# EAGLE design sonar_preprocessor (EAGLE 9.2.2)

## Sheet 1 of 7: Amplifier
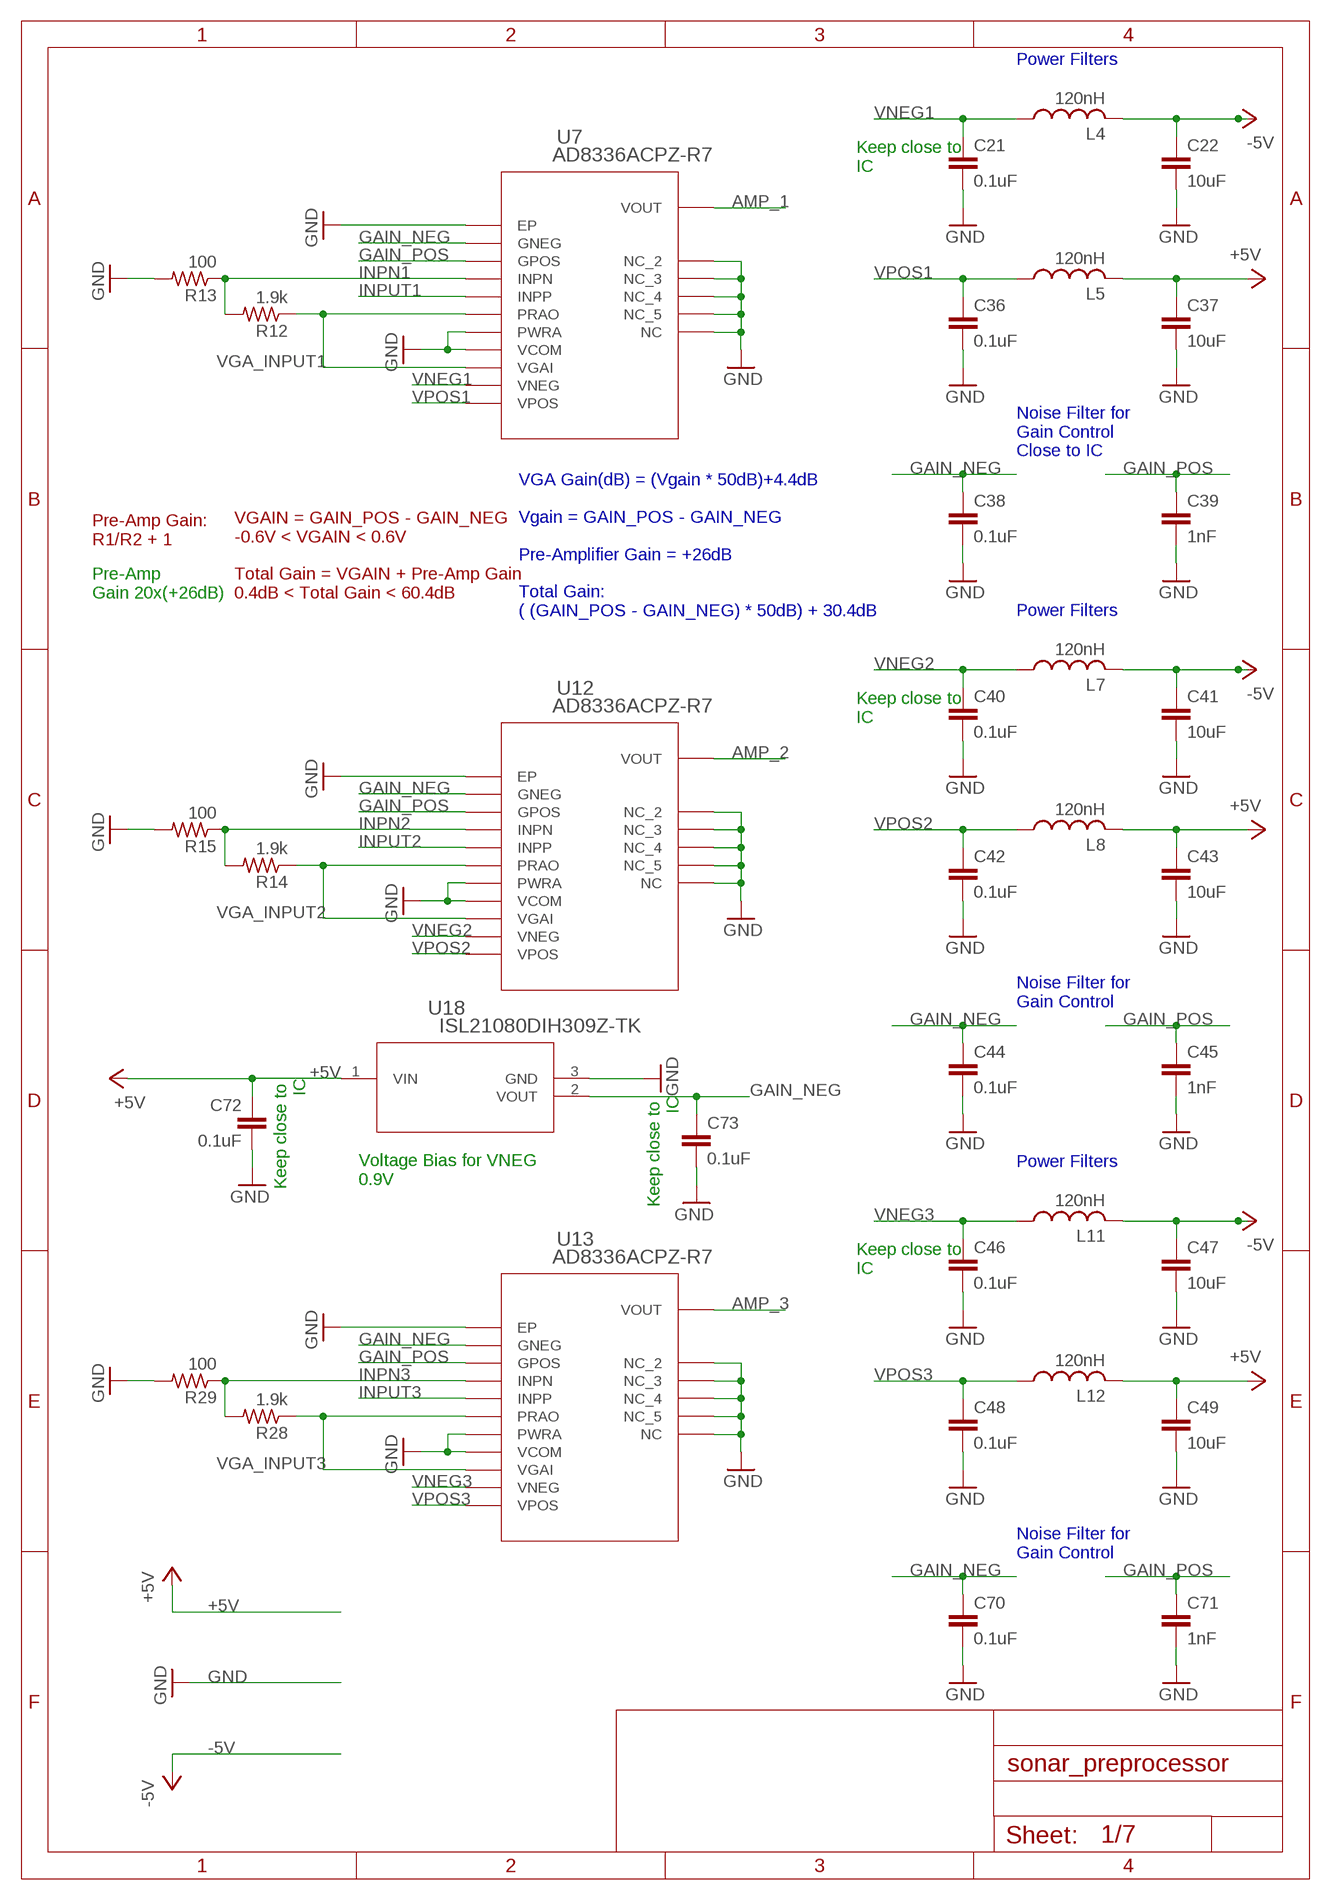
[diagram p0: schematic, sheet 1]

### Parts
C21  0.1uF  C-EUC0603  [C0603]
C22  10uF  C-EUC1206  [C1206]
C36  0.1uF  C-EUC0603  [C0603]
C37  10uF  C-EUC1206  [C1206]
C38  0.1uF  C-EUC0603  [C0603]
C39  1nF  C-EUC0603  [C0603]
C40  0.1uF  C-EUC0603  [C0603]
C41  10uF  C-EUC1206  [C1206]
C42  0.1uF  C-EUC0603  [C0603]
C43  10uF  C-EUC1206  [C1206]
C44  0.1uF  C-EUC0603  [C0603]
C45  1nF  C-EUC0603  [C0603]
C46  0.1uF  C-EUC0603  [C0603]
C47  10uF  C-EUC1206  [C1206]
C48  0.1uF  C-EUC0603  [C0603]
C49  10uF  C-EUC1206  [C1206]
C70  0.1uF  C-EUC0603  [C0603]
C71  1nF  C-EUC0603  [C0603]
C72  0.1uF  C-EUC0603  [C0603]
C73  0.1uF  C-EUC0603  [C0603]
L4  120nH  L-USL3225P  [L3225P]
L5  120nH  L-USL3225P  [L3225P]
L7  120nH  L-USL3225P  [L3225P]
L8  120nH  L-USL3225P  [L3225P]
L11  120nH  L-USL3225P  [L3225P]
L12  120nH  L-USL3225P  [L3225P]
R12  1.9k  R-US_R0603  [R0603]
R13  100  R-US_R0603  [R0603]
R14  1.9k  R-US_R0603  [R0603]
R15  100  R-US_R0603  [R0603]
R28  1.9k  R-US_R0603  [R0603]
R29  100  R-US_R0603  [R0603]
U7  AD8336ACPZ-R7  [CP_16_4]
U12  AD8336ACPZ-R7  [CP_16_4]
U13  AD8336ACPZ-R7  [CP_16_4]
U18  ISL21080DIH309Z-TK  [P3_064]

### Nets
+5V: C37.1 C43.1 C49.1 C72.1 L5.2 L8.2 L12.2 U18.1(VIN) ; also sheet 2,3,4,5,6,7
-5V: C22.1 C41.1 C47.1 L4.2 L7.2 L11.2 ; also sheet 2,5,6,7
AMP_1: U7.VOUT ; also sheet 2,6
AMP_2: U12.VOUT ; also sheet 2,6
AMP_3: U13.VOUT ; also sheet 2,6
GAIN_NEG: C38.1 C44.1 C70.1 C73.1 U7.GNEG U12.GNEG U13.GNEG U18.2(VOUT)
GAIN_POS: C39.1 C45.1 C71.1 U7.GPOS U12.GPOS U13.GPOS ; also sheet 6
GND: C21.2 C22.2 C36.2 C37.2 C38.2 C39.2 C40.2 C41.2 C42.2 C43.2 C44.2 C45.2 C46.2 C47.2 C48.2 C49.2 C70.2 C71.2 C72.2 C73.2 R13.2 R15.2 R29.2 U7.GND1(EP) U7.NC U7.NC1(NC_2) U7.NC2(NC_3) U7.NC3(NC_4) U7.NC4(NC_5) U7.PWRA U7.VCOM U12.GND1(EP) U12.NC U12.NC1(NC_2) U12.NC2(NC_3) U12.NC3(NC_4) U12.NC4(NC_5) U12.PWRA U12.VCOM U13.GND1(EP) U13.NC U13.NC1(NC_2) U13.NC2(NC_3) U13.NC3(NC_4) U13.NC4(NC_5) U13.PWRA U13.VCOM U18.3(GND) ; also sheet 2,3,4,5,6,7
INPN1: R12.2 R13.1 U7.INPN
INPN2: R14.2 R15.1 U12.INPN
INPN3: R28.2 R29.1 U13.INPN
INPUT1: U7.INPP ; also sheet 6,7
INPUT2: U12.INPP ; also sheet 6,7
INPUT3: U13.INPP ; also sheet 6,7
VGA_INPUT1: R12.1 U7.PRAO U7.VGAI
VGA_INPUT2: R14.1 U12.PRAO U12.VGAI
VGA_INPUT3: R28.1 U13.PRAO U13.VGAI
VNEG1: C21.1 L4.1 U7.VNEG
VNEG2: C40.1 L7.1 U12.VNEG
VNEG3: C46.1 L11.1 U13.VNEG
VPOS1: C36.1 L5.1 U7.VPOS
VPOS2: C42.1 L8.1 U12.VPOS
VPOS3: C48.1 L12.1 U13.VPOS

### Notes on the sheet
- Power Filters
- Keep close to 
  IC
- Noise Filter for
  Gain Control
  Close to IC
- Pre-Amp Gain:
  R1/R2 + 1
- Pre-Amp 
  Gain 20x(+26dB)
- VGAIN = GAIN_POS - GAIN_NEG
  -0.6V < VGAIN < 0.6V
  
  Total Gain = VGAIN + Pre-Amp Gain
  0.4dB < Total Gain < 60.4dB
- VGA Gain(dB) = (Vgain * 50dB)+4.4dB
  
  Vgain = GAIN_POS - GAIN_NEG
  
  Pre-Amplifier Gain = +26dB
  
  Total Gain:
  ( (GAIN_POS - GAIN_NEG) * 50dB) + 30.4dB
- Power Filters
- Keep close to 
  IC
- Noise Filter for
  Gain Control
- Keep close to 
  IC
- Keep close to 
  IC
- Power Filters
- Voltage Bias for VNEG
  0.9V
- Keep close to 
  IC
- Noise Filter for
  Gain Control

## Sheet 2 of 7: Filter
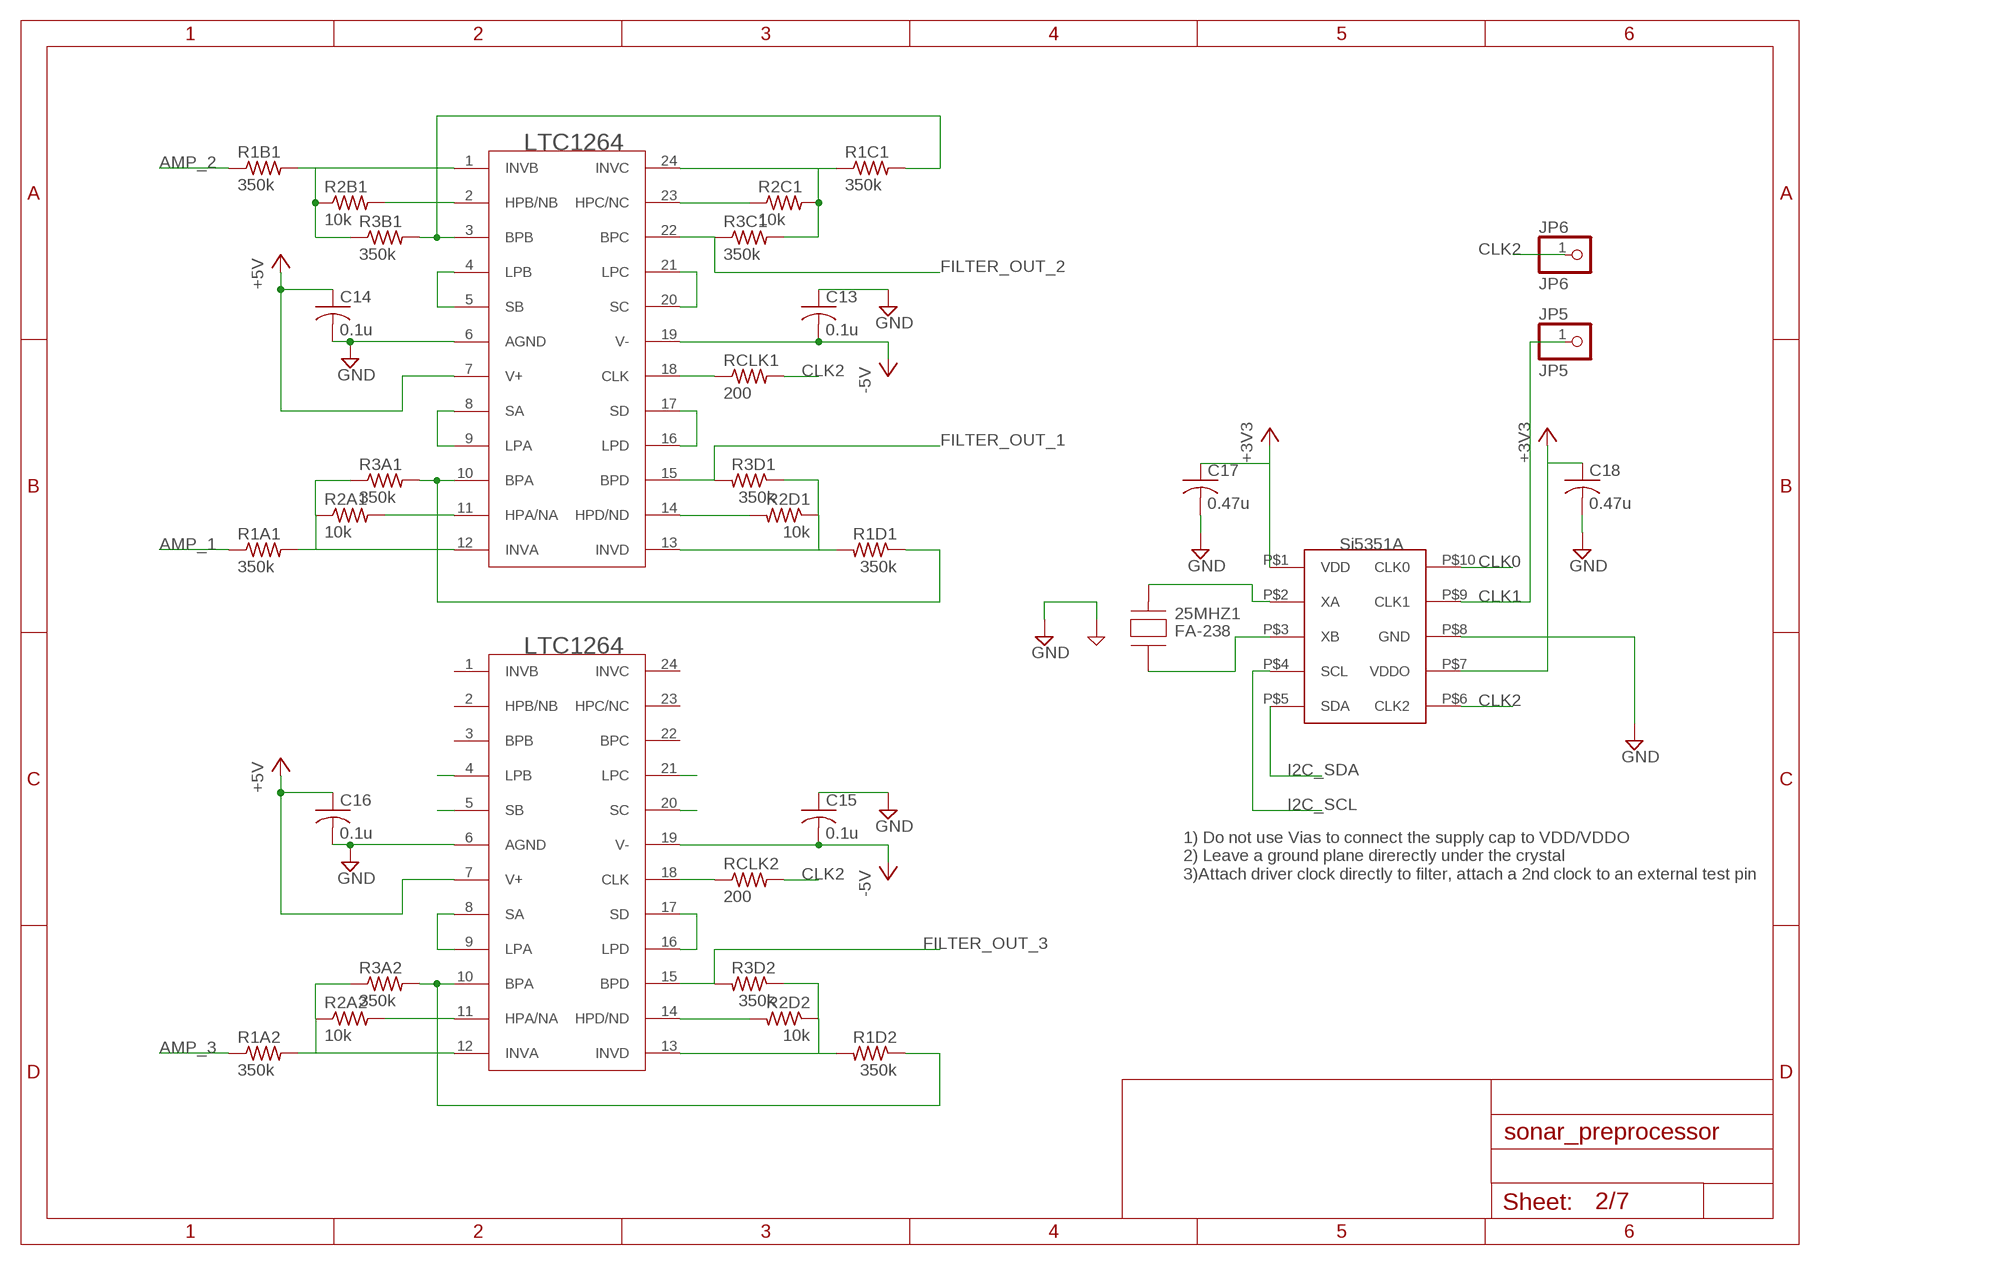
[diagram p1: schematic, sheet 2]

### Parts
25MHZ1  FA-238  [FA-238]
C13  0.1u  C-USC0805  [C0805]
C14  0.1u  C-USC0805  [C0805]
C15  0.1u  C-USC0805  [C0805]
C16  0.1u  C-USC0805  [C0805]
C17  0.47u  C-USC0805  [C0805]
C18  0.47u  C-USC0805  [C0805]
JP5  JP5  PINHD-1X1  [1X01]
JP6  JP6  PINHD-1X1  [1X01]
R1A1  350k  R-US_R0805  [R0805]
R1A2  350k  R-US_R0805  [R0805]
R1B1  350k  R-US_R0805  [R0805]
R1C1  350k  R-US_R0805  [R0805]
R1D1  350k  R-US_R0805  [R0805]
R1D2  350k  R-US_R0805  [R0805]
R2A1  10k  R-US_R0805  [R0805]
R2A2  10k  R-US_R0805  [R0805]
R2B1  10k  R-US_R0805  [R0805]
R2C1  10k  R-US_R0805  [R0805]
R2D1  10k  R-US_R0805  [R0805]
R2D2  10k  R-US_R0805  [R0805]
R3A1  350k  R-US_R0805  [R0805]
R3A2  350k  R-US_R0805  [R0805]
R3B1  350k  R-US_R0805  [R0805]
R3C1  350k  R-US_R0805  [R0805]
R3D1  350k  R-US_R0805  [R0805]
R3D2  350k  R-US_R0805  [R0805]
RCLK1  200  R-US_R0805  [R0805]
RCLK2  200  R-US_R0805  [R0805]
U$6  LTC1264SMD  [SO24W]
U$7  LTC1264SMD  [SO24W]
U$8  SI5351A  [MSOP-10]

### Nets
+3V3: C17.1 C18.1 U$8.P$1(VDD) U$8.P$7(VDDO) ; also sheet 6
+5V: C14.1 C16.1 U$6.7(V+) U$7.7(V+) ; also sheet 1,3,4,5,6,7
-5V: C13.2 C15.2 U$6.19(V-) U$7.19(V-) ; also sheet 1,5,6,7
AMP_1: R1A1.1 ; also sheet 1,6
AMP_2: R1B1.1 ; also sheet 1,6
AMP_3: R1A2.1 ; also sheet 1,6
CLK0: U$8.P$10(CLK0)
CLK1: JP5.1 U$8.P$9(CLK1)
CLK2: JP6.1 RCLK1.2 RCLK2.2 U$8.P$6(CLK2)
FILTER_OUT_1: R3D1.2 U$6.15(BPD) ; also sheet 3,6
FILTER_OUT_2: R3C1.1 U$6.22(BPC) ; also sheet 3,6
FILTER_OUT_3: R3D2.2 U$7.15(BPD) ; also sheet 3,6
GND: 25MHZ1.P$1(GND) 25MHZ1.P$3(GND) C13.1 C14.2 C15.1 C16.2 C17.2 C18.2 U$6.6(AGND) U$7.6(AGND) U$8.P$8(GND) ; also sheet 1,3,4,5,6,7
I2C_SCL: U$8.P$4(SCL) ; also sheet 6
I2C_SDA: U$8.P$5(SDA) ; also sheet 6
N$7: U$7.20(SC)
N$8: U$7.5(SB)
N$9: 25MHZ1.P$4(XA) U$8.P$2(XA)
N$10: 25MHZ1.P$2(XB) U$8.P$3(XB)
N$24: R2A1.2 U$6.11(HPA/NA)
N$25: U$6.8(SA) U$6.9(LPA)
N$26: R1A1.2 R2A1.1 R3A1.1 U$6.12(INVA)
N$27: R2D1.2 U$6.14(HPD/ND)
N$28: R1D1.2 R2D1.1 R3D1.1 U$6.13(INVD)
N$29: U$6.16(LPD) U$6.17(SD)
N$30: R2C1.1 U$6.23(HPC/NC)
N$31: R1C1.1 R2C1.2 R3C1.2 U$6.24(INVC)
N$33: R2B1.2 U$6.2(HPB/NB)
N$34: R1B1.2 R2B1.1 R3B1.1 U$6.1(INVB)
N$35: U$6.4(LPB) U$6.5(SB)
N$36: U$6.20(SC) U$6.21(LPC)
N$37: RCLK1.1 U$6.18(CLK)
N$38: R2A2.2 U$7.11(HPA/NA)
N$39: U$7.8(SA) U$7.9(LPA)
N$40: R1A2.2 R2A2.1 R3A2.1 U$7.12(INVA)
N$41: R2D2.2 U$7.14(HPD/ND)
N$42: R1D2.2 R2D2.1 R3D2.1 U$7.13(INVD)
N$43: U$7.16(LPD) U$7.17(SD)
N$48: U$7.4(LPB)
N$49: U$7.21(LPC)
N$50: RCLK2.1 U$7.18(CLK)
OUT_2ND_A1: R1D1.1 R3A1.2 U$6.10(BPA)
OUT_2ND_A2: R1D2.1 R3A2.2 U$7.10(BPA)
OUT_2ND_ORDER_B1: R1C1.2 R3B1.2 U$6.3(BPB)
Unconnected: U$7.1(INVB) U$7.2(HPB/NB) U$7.3(BPB) U$7.22(BPC) U$7.23(HPC/NC) U$7.24(INVC)

### Notes on the sheet
- 1) Do not use Vias to connect the supply cap to VDD/VDDO
  2) Leave a ground plane direrectly under the crystal
  3)Attach driver clock directly to filter, attach a 2nd clock to an external test pin

## Sheet 3 of 7: Bias_and_Clamp
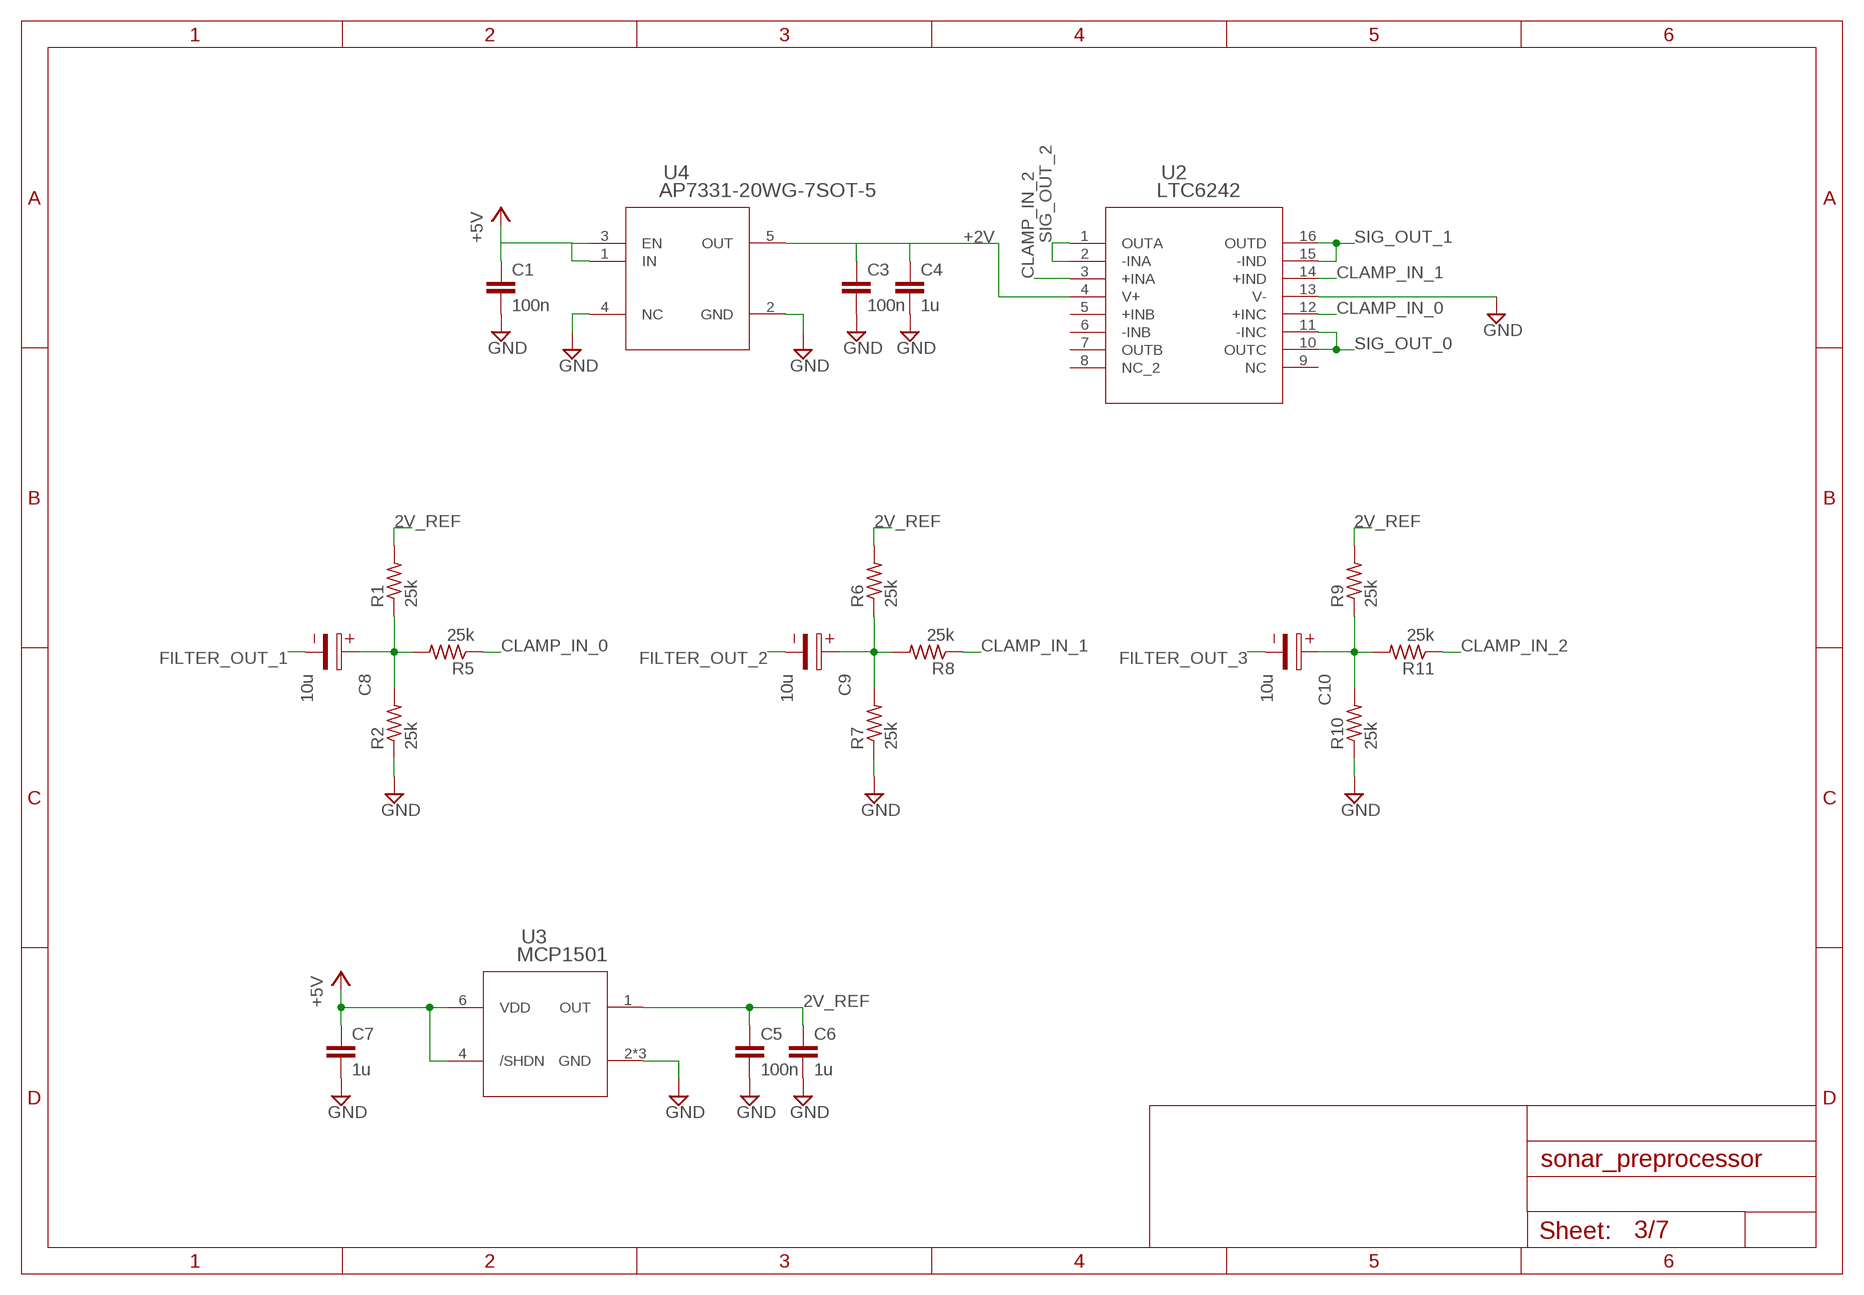
[diagram p2: schematic, sheet 3]

### Parts
C1  100n  C-EUC0805  [C0805]
C3  100n  C-EUC0805  [C0805]
C4  1u  C-EUC0805  [C0805]
C5  100n  C-EUC0805  [C0805]
C6  1u  C-EUC0805  [C0805]
C7  1u  C-EUC0805  [C0805]
C8  10u  WCAP-AS5H_4X5,5_865230340001  [2.6X1.6X1(BXCXA)]
C9  10u  WCAP-AS5H_4X5,5_865230340001  [2.6X1.6X1(BXCXA)]
C10  10u  WCAP-AS5H_4X5,5_865230340001  [2.6X1.6X1(BXCXA)]
R1  25k  R-US_R0805  [R0805]
R2  25k  R-US_R0805  [R0805]
R5  25k  R-US_R0805  [R0805]
R6  25k  R-US_R0805  [R0805]
R7  25k  R-US_R0805  [R0805]
R8  25k  R-US_R0805  [R0805]
R9  25k  R-US_R0805  [R0805]
R10  25k  R-US_R0805  [R0805]
R11  25k  R-US_R0805  [R0805]
U2  LTC6242  LTC6242IGNPBFSSOP16  [SSOP16]
U3  MCP1501  [SOT23-6]
U4  AP7331-20WG-7SOT-5  [SOT23-5]

### Nets
2V_REF: C5.1 C6.1 R1.2 R6.2 R9.2 U3.1(OUT)
+2V: C3.1 C4.1 U2.4(V+) U4.5(OUT)
+5V: C1.1 C7.1 U3.4(/SHDN) U3.6(VDD) U4.1(IN) U4.3(EN) ; also sheet 1,2,4,5,6,7
BIASED_0: C8.1 R1.1 R2.2 R5.2
BIASED_1: C9.1 R6.1 R7.2 R8.2
BIASED_2: C10.1 R9.1 R10.2 R11.2
CLAMP_IN_0: R5.1 U2.12(+INC)
CLAMP_IN_1: R8.1 U2.14(+IND)
CLAMP_IN_2: R11.1 U2.3(+INA)
FILTER_OUT_1: C8.2 ; also sheet 2,6
FILTER_OUT_2: C9.2 ; also sheet 2,6
FILTER_OUT_3: C10.2 ; also sheet 2,6
GND: C1.2 C3.2 C4.2 C5.2 C6.2 C7.2 R2.1 R7.1 R10.1 U2.13(V-) U4.2(GND) U4.4(NC) ; also sheet 1,2,4,5,6,7
SIG_OUT_0: U2.10(OUTC) U2.11(-INC) ; also sheet 6
SIG_OUT_1: U2.15(-IND) U2.16(OUTD) ; also sheet 6
SIG_OUT_2: U2.1(OUTA) U2.2(-INA) ; also sheet 4,6
Unconnected: U2.5(+INB) U2.6(-INB) U2.7(OUTB) U2.8(NC_2) U2.9(NC)

## Sheet 4 of 7: Peak Detector
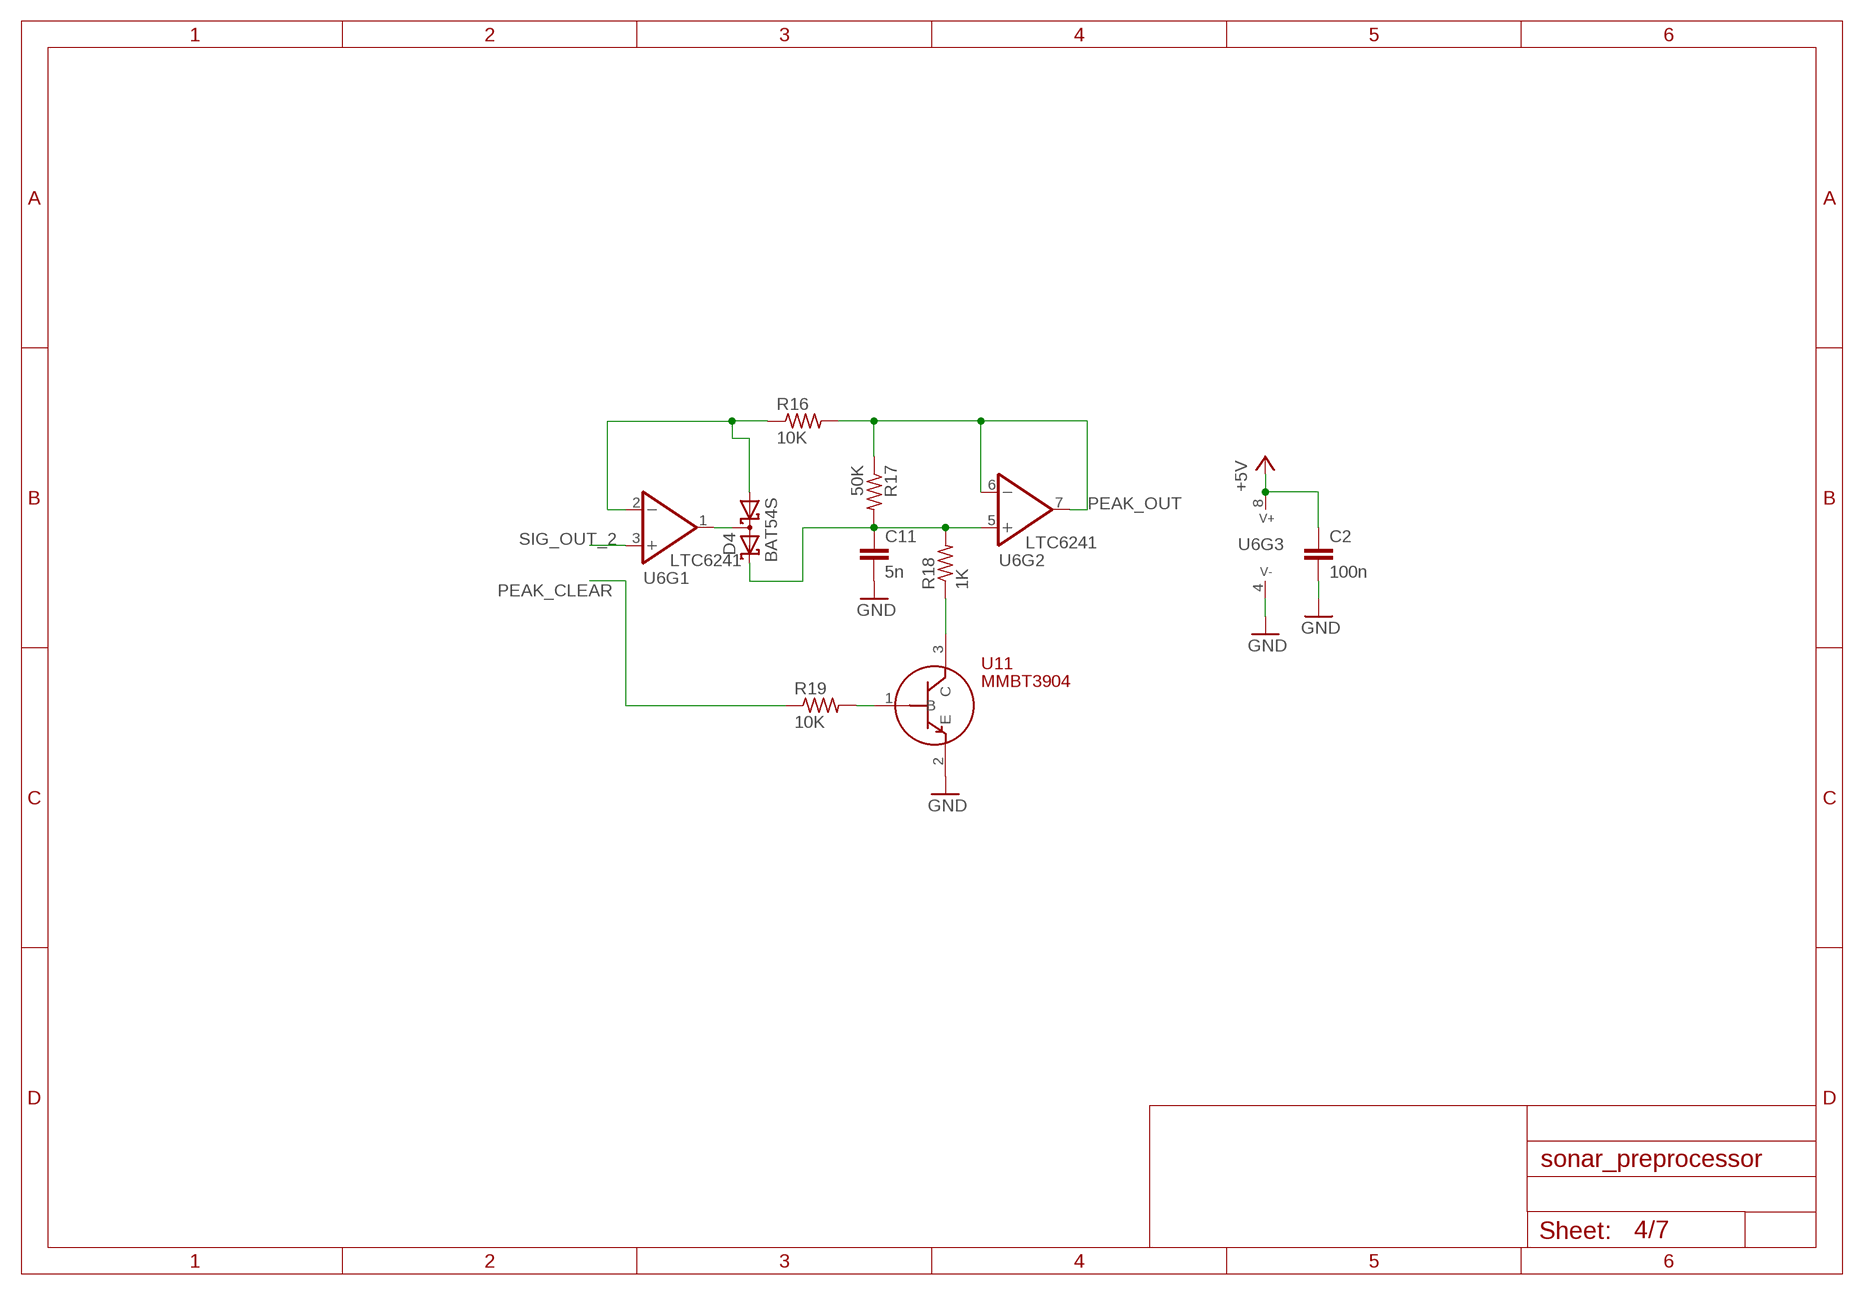
[diagram p3: schematic, sheet 4]

### Parts
C2  100n  C-EUC0805  [C0805]
C11  5n  C-EUC0805  [C0805]
D4  BAT54S  [SOT23]
R16  10K  R-US_R0805  [R0805]
R17  50K  R-US_R0805  [R0805]
R18  1K  R-US_R0805  [R0805]
R19  10K  R-US_R0805  [R0805]
U6  LTC6241  [SO-8]
U11  MMBT3904  [SOT23]

### Nets
+5V: C2.1 U6.8(V+) ; also sheet 1,2,3,5,6,7
GND: C2.2 C11.2 U6.4(V-) U11.2(E) ; also sheet 1,2,3,5,6,7
N$12: C11.1 D4.2(C2) R17.2 R18.2 U6.5(+IN)
N$13: D4.1(A1) R16.1 U6.2(-IN)
N$14: D4.3(C1A2) U6.1(OUT)
N$15: R19.2 U11.1(B)
N$16: R18.1 U11.3(C)
PEAK_CLEAR: R19.1 ; also sheet 6
PEAK_OUT: R16.2 R17.1 U6.6(-IN) U6.7(OUT) ; also sheet 6
SIG_OUT_2: U6.3(+IN) ; also sheet 3,6

## Sheet 5 of 7: Power_Supply
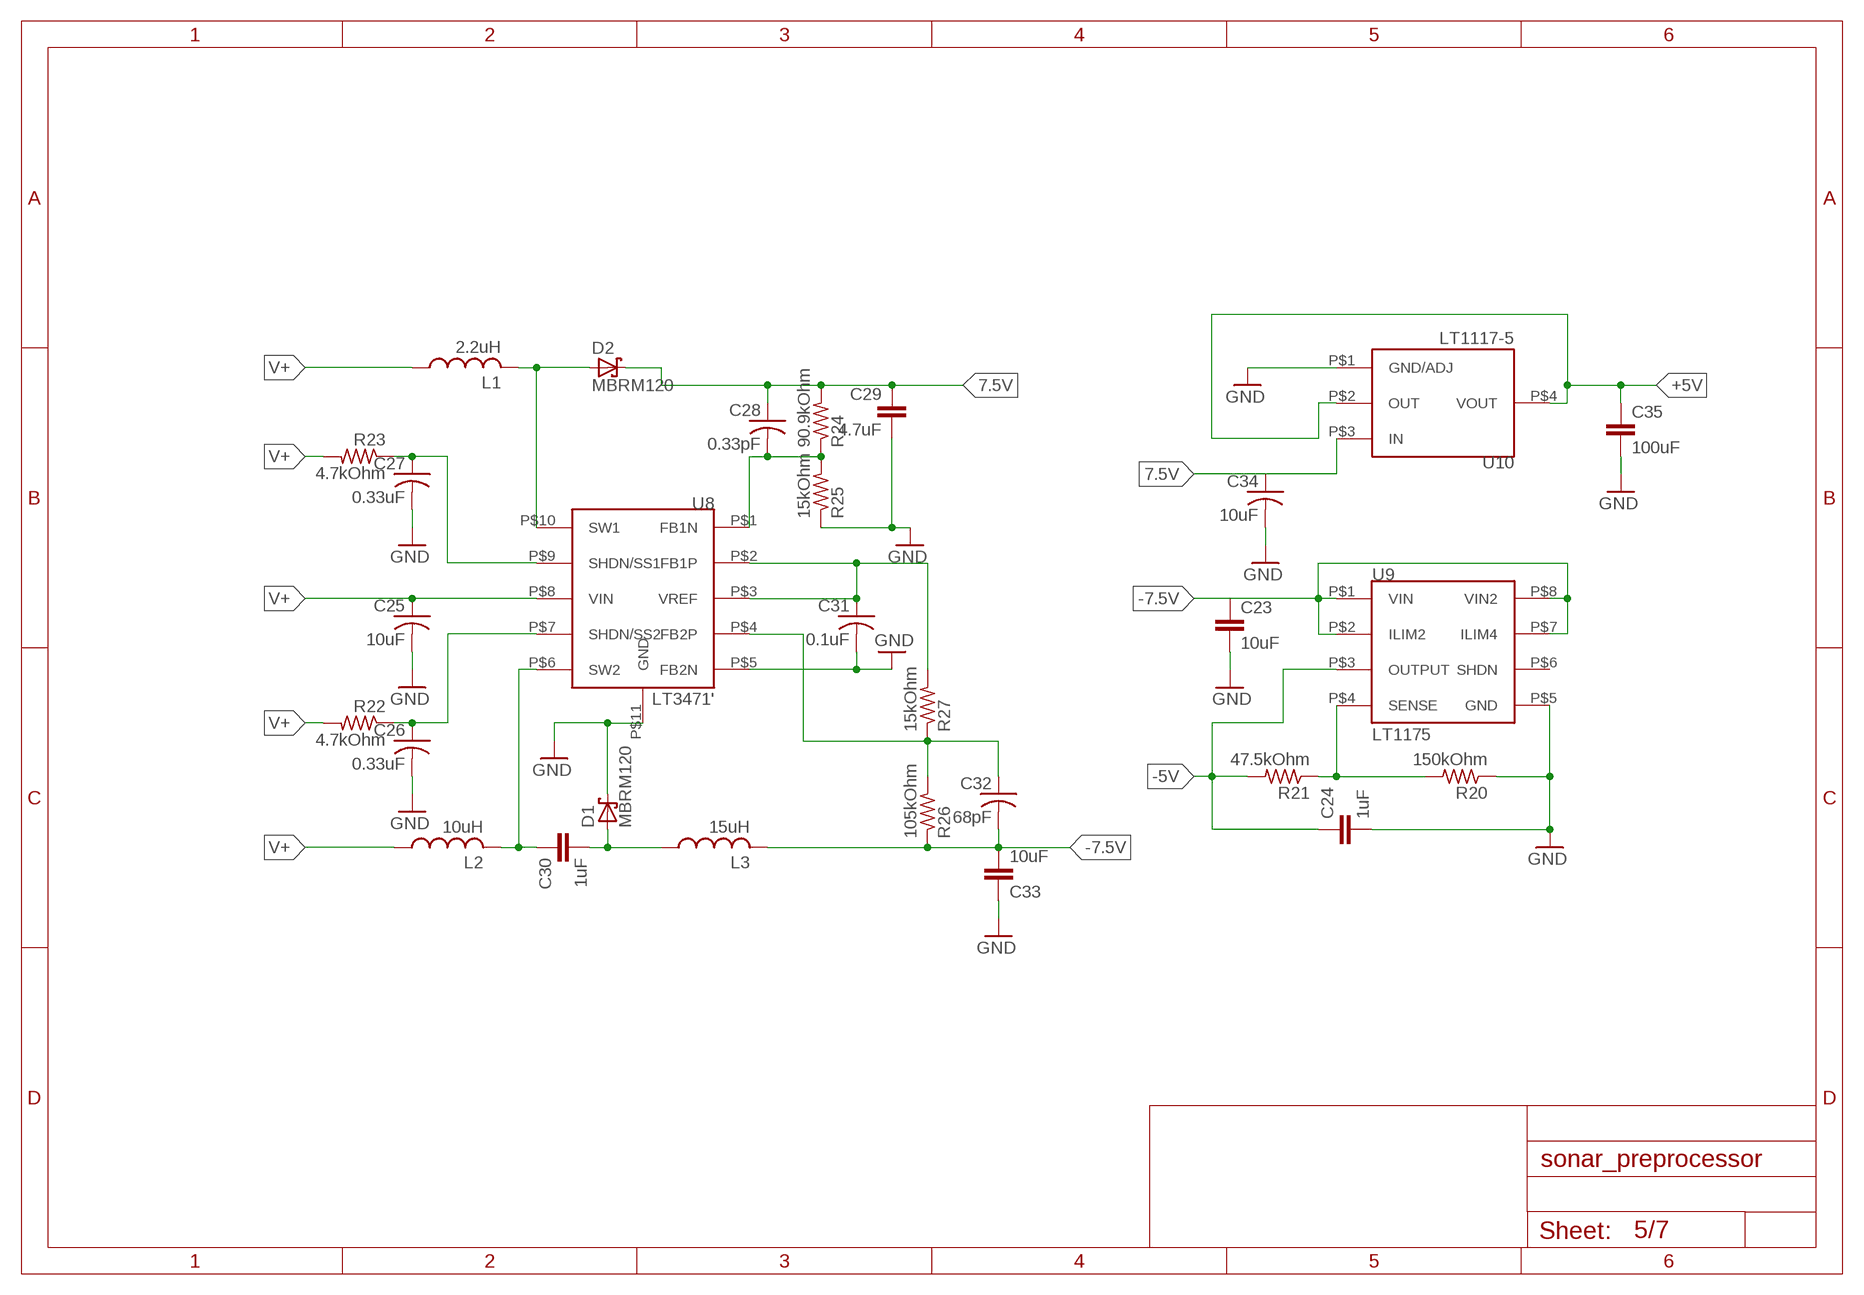
[diagram p4: schematic, sheet 5]

### Parts
C23  10uF  C-EUC0805  [C0805]
C24  1uF  C-EUC1206  [C1206]
C25  10uF  C-USC0603  [C0603]
C26  0.33uF  C-USC0603  [C0603]
C27  0.33uF  C-USC0603  [C0603]
C28  0.33pF  C-USC0603  [C0603]
C29  4.7uF  C-EUC1206  [C1206]
C30  1uF  C-EUC1206  [C1206]
C31  0.1uF  C-USC0603  [C0603]
C32  68pF  C-USC0603  [C0603]
C33  10uF  C-EUC0805  [C0805]
C34  10uF  C-USC0603  [C0603]
C35  100uF  C-EUC1210  [C1210]
D1  MBRM120  [DO-216AA]
D2  MBRM120  [DO-216AA]
L1  2.2uH  LQH5BPN2R2N38L  [NS4.9X4.9]
L2  10uH  VLS5045EX-100M2  [NS5X5]
L3  15uH  VLS5045EX-150M-CA1  [NS5X5]
R20  150kOhm  R-US_R0603  [R0603]
R21  47.5kOhm  R-US_R0603  [R0603]
R22  4.7kOhm  R-US_R0603  [R0603]
R23  4.7kOhm  R-US_R0603  [R0603]
R24  90.9kOhm  R-US_R0603  [R0603]
R25  15kOhm  R-US_R0603  [R0603]
R26  105kOhm  R-US_R0603  [R0603]
R27  15kOhm  R-US_R0603  [R0603]
U8  LT3471'  [10-WFDFN]
U9  LT1175  [8-SOIC]
U10  LT1117-5  [SOT233-3]

### Nets
7.5V: C28.1 C29.1 C34.1 D2.P$1(C) R24.2 U10.P$3(IN)
+5V: C35.1 U10.P$2(OUT) U10.P$4(VOUT) ; also sheet 1,2,3,4,6,7
-5V: C24.1 R21.2 U9.P$3(OUTPUT) ; also sheet 1,2,6,7
-7.5V: C23.1 C32.2 C33.2 L3.P$2 R26.1 U9.P$1(VIN) U9.P$2(ILIM2) U9.P$7(ILIM4) U9.P$8(VIN2)
GND: C23.2 C24.2 C25.2 C26.2 C27.2 C29.2 C31.2 C33.1 C34.2 C35.2 D1.P$1(C) R20.1 R25.1 U8.P$5(FB2N) U8.P$11(GND) U9.P$5(GND) U10.P$1(GND/ADJ) ; also sheet 1,2,3,4,6,7
N$1: R20.2 R21.1 U9.P$4(SENSE)
N$2: D2.P$2(A) L1.P$2 U8.P$10(SW1)
N$3: C28.2 R24.1 R25.2 U8.P$1(FB1N)
N$4: C30.1 L2.P$2 U8.P$6(SW2)
N$5: C30.2 D1.P$2(A) L3.P$1
N$6: C32.1 R26.2 R27.1 U8.P$4(FB2P)
SS3: C26.1 R22.1 U8.P$7(SHDN/SS2)
SS4: C27.1 R23.1 U8.P$9(SHDN/SS1)
V+: C25.1 L1.P$1 L2.P$1 R22.2 R23.2 U8.P$8(VIN) ; also sheet 6
VREF: C31.1 R27.2 U8.P$2(FB1P) U8.P$3(VREF)
Unconnected: U9.P$6(SHDN)

## Sheet 6 of 7: Microcontroller and General Interconnect
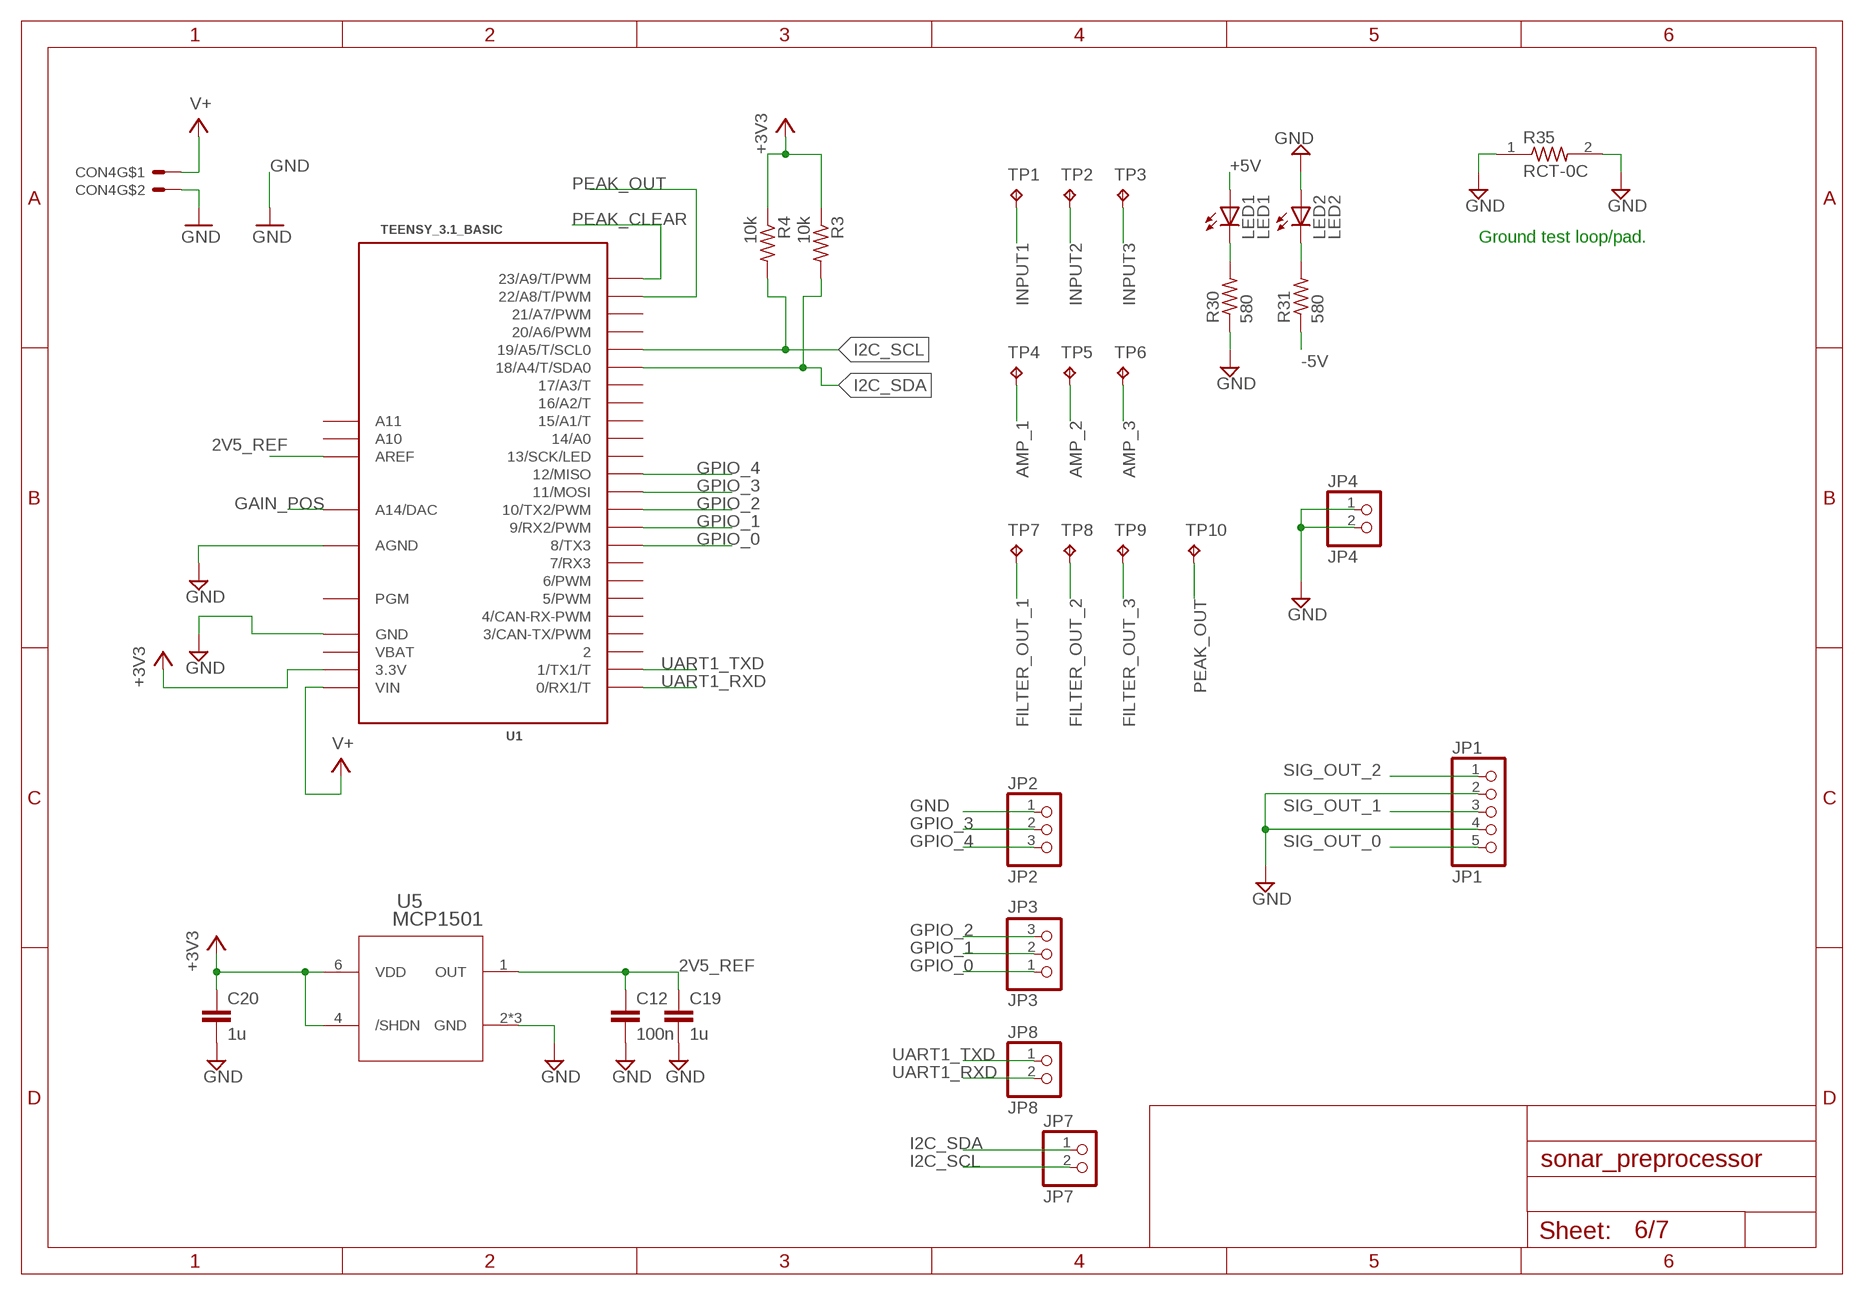
[diagram p5: schematic, sheet 6]

### Parts
C12  100n  C-EUC0805  [C0805]
C19  1u  C-EUC0805  [C0805]
C20  1u  C-EUC0805  [C0805]
CON4  MOLEX_5566-2  [5566-2]
JP1  JP1  PINHD-1X5/90  [1X05/90]
JP2  JP2  PINHD-1X03_2.54-SMD-90°  [1X03SMD/90]
JP3  JP3  PINHD-1X03_2.54-SMD-90°  [1X03SMD/90]
JP4  JP4  PINHD-1X2  [1X02]
JP7  JP7  PINHD-1X2  [1X02]
JP8  JP8  PINHD-1X02_2.54-SMD-90°  [1X02SMD/90]
LED1  LED1  LEDSML0805  [SML0805]
LED2  LED2  LEDSML0805  [SML0805]
R3  10k  R-US_R0805  [R0805]
R4  10k  R-US_R0805  [R0805]
R30  580  R-US_R0805  [R0805]
R31  580  R-US_R0805  [R0805]
R35  RCT-0C  [RESC2012X65N]
TP1  TPB2,54  [B2,54]
TP2  TPB2,54  [B2,54]
TP3  TPB2,54  [B2,54]
TP4  TPB2,54  [B2,54]
TP5  TPB2,54  [B2,54]
TP6  TPB2,54  [B2,54]
TP7  TPB2,54  [B2,54]
TP8  TPB2,54  [B2,54]
TP9  TPB2,54  [B2,54]
TP10  TPB2,54  [B2,54]
U1  TEENSY_3.1_BASIC  [TEENSY_3.1_BASIC]
U5  MCP1501  [SOT23-6]

### Nets
2V5_REF: C12.1 C19.1 U1.AREF U5.1(OUT)
+3V3: C20.1 R3.1 R4.1 U1.3.3V U1.3.3V1(3.3V) U5.4(/SHDN) U5.6(VDD) ; also sheet 2
+5V: LED1.A ; also sheet 1,2,3,4,5,7
-5V: R31.1 ; also sheet 1,2,5,7
AMP_1: TP4.TP ; also sheet 1,2
AMP_2: TP5.TP ; also sheet 1,2
AMP_3: TP6.TP ; also sheet 1,2
FILTER_OUT_1: TP7.TP ; also sheet 2,3
FILTER_OUT_2: TP8.TP ; also sheet 2,3
FILTER_OUT_3: TP9.TP ; also sheet 2,3
GAIN_POS: U1.A14(A14/DAC) ; also sheet 1
GND: C12.2 C19.2 C20.2 CON4.2 JP1.2 JP1.4 JP2.1 JP4.1 JP4.2 LED2.A R30.1 R35.1 R35.2 U1.AGND U1.GND U1.GND1(GND) U5.2(GND) U5.3(GND) U5.5(GND) ; also sheet 1,2,3,4,5,7
GPIO_0: JP3.1 U1.8(8/TX3)
GPIO_1: JP3.2 U1.9(9/RX2/PWM)
GPIO_2: JP3.3 U1.10(10/TX2/PWM)
GPIO_3: JP2.2 U1.11(11/MOSI)
GPIO_4: JP2.3 U1.12(12/MISO)
I2C_SCL: JP7.2 R4.2 U1.19/A5(19/A5/T/SCL0) ; also sheet 2
I2C_SDA: JP7.1 R3.2 U1.18/A4(18/A4/T/SDA0) ; also sheet 2
INPUT1: TP1.TP ; also sheet 1,7
INPUT2: TP2.TP ; also sheet 1,7
INPUT3: TP3.TP ; also sheet 1,7
N$11: LED2.C R31.2
N$17: LED1.C R30.2
PEAK_CLEAR: U1.23/A9(23/A9/T/PWM) ; also sheet 4
PEAK_OUT: TP10.TP U1.22/A8(22/A8/T/PWM) ; also sheet 4
SIG_OUT_0: JP1.5 ; also sheet 3
SIG_OUT_1: JP1.3 ; also sheet 3
SIG_OUT_2: JP1.1 ; also sheet 3,4
UART1_RXD: JP8.2 U1.0(0/RX1/T)
UART1_TXD: JP8.1 U1.1(1/TX1/T)
V+: CON4.1 U1.VIN ; also sheet 5
Unconnected: U1.2 U1.3(3/CAN-TX/PWM) U1.4(4/CAN-RX-PWM) U1.5(5/PWM) U1.6(6/PWM) U1.7(7/RX3) U1.13(13/SCK/LED) U1.14/A0 U1.15/A1(15/A1/T) U1.16/A2(16/A2/T) U1.17/A3(17/A3/T) U1.20/A6(20/A6/PWM) U1.21/A7(21/A7/PWM) U1.A10 U1.A11 U1.PGM

### Notes on the sheet
- Ground test loop/pad.

## Sheet 7 of 7: Input Buffer
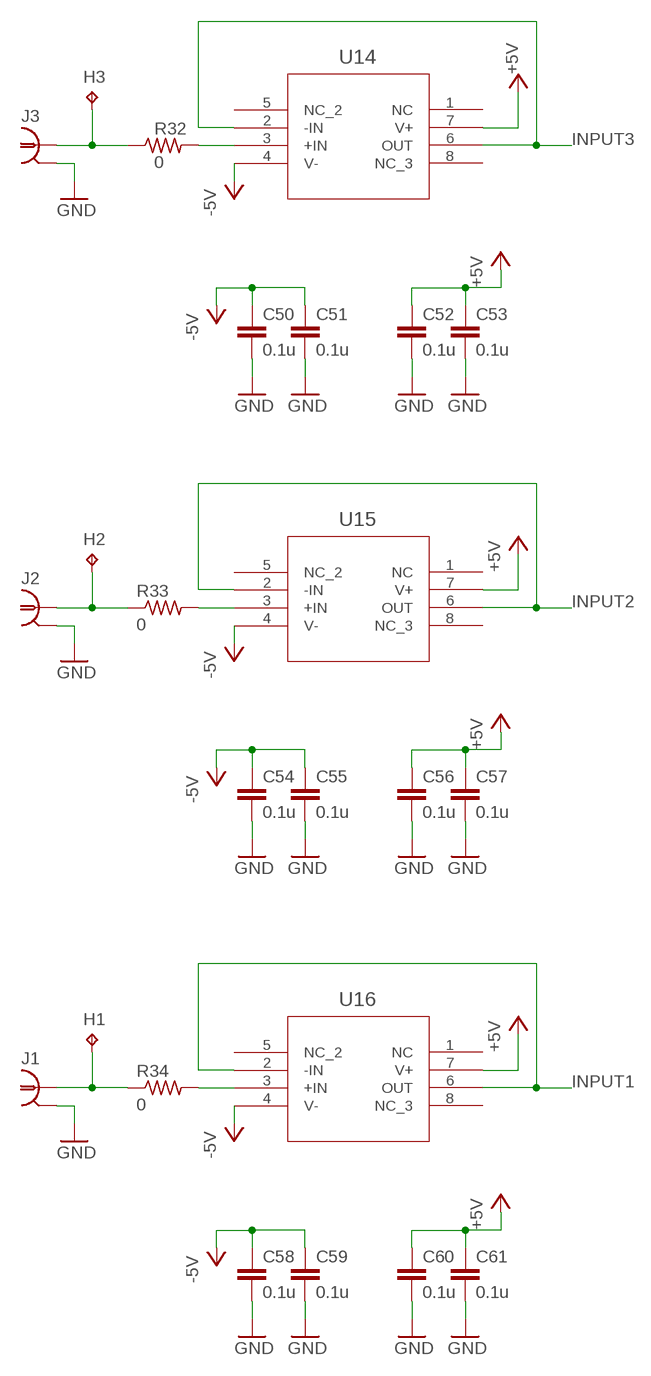
[diagram p6: schematic, sheet 7]

### Parts
C50  0.1u  C-EUC0603  [C0603]
C51  0.1u  C-EUC0603  [C0603]
C52  0.1u  C-EUC0603  [C0603]
C53  0.1u  C-EUC0603  [C0603]
C54  0.1u  C-EUC0603  [C0603]
C55  0.1u  C-EUC0603  [C0603]
C56  0.1u  C-EUC0603  [C0603]
C57  0.1u  C-EUC0603  [C0603]
C58  0.1u  C-EUC0603  [C0603]
C59  0.1u  C-EUC0603  [C0603]
C60  0.1u  C-EUC0603  [C0603]
C61  0.1u  C-EUC0603  [C0603]
H1  TPB2,54  [B2,54]
H2  TPB2,54  [B2,54]
H3  TPB2,54  [B2,54]
J1  TE_5-1634503-1TE  [TE_5-1634503-1]
J2  TE_5-1634503-1TE  [TE_5-1634503-1]
J3  TE_5-1634503-1TE  [TE_5-1634503-1]
R32  0  R-US_R0603  [R0603]
R33  0  R-US_R0603  [R0603]
R34  0  R-US_R0603  [R0603]
U14  U14  LTC6240SO-8  [SO-8]
U15  U15  LTC6240SO-8  [SO-8]
U16  U16  LTC6240SO-8  [SO-8]

### Nets
+5V: C52.1 C53.1 C56.1 C57.1 C60.1 C61.1 U14.7(V+) U15.7(V+) U16.7(V+) ; also sheet 1,2,3,4,5,6
-5V: C50.1 C51.1 C54.1 C55.1 C58.1 C59.1 U14.4(V-) U15.4(V-) U16.4(V-) ; also sheet 1,2,5,6
GND: C50.2 C51.2 C52.2 C53.2 C54.2 C55.2 C56.2 C57.2 C58.2 C59.2 C60.2 C61.2 J1.2 J1.3 J1.4 J1.5 J2.2 J2.3 J2.4 J2.5 J3.2 J3.3 J3.4 J3.5 ; also sheet 1,2,3,4,5,6
INPUT1: U16.2(-IN) U16.6(OUT) ; also sheet 1,6
INPUT2: U15.2(-IN) U15.6(OUT) ; also sheet 1,6
INPUT3: U14.2(-IN) U14.6(OUT) ; also sheet 1,6
N$18: H3.TP J3.1 R32.1
N$19: R32.2 U14.3(+IN)
N$20: H2.TP J2.1 R33.1
N$21: R33.2 U15.3(+IN)
N$22: R34.2 U16.3(+IN)
N$23: H1.TP J1.1 R34.1
Unconnected: U14.1(NC) U14.5(NC_2) U14.8(NC_3) U15.1(NC) U15.5(NC_2) U15.8(NC_3) U16.1(NC) U16.5(NC_2) U16.8(NC_3)

## Power pins joined to a net without a drawn wire
GND: U3.2(GND) U3.3(GND) U3.5(GND)
VBAT: U1.VBAT

## Library data of the parts
25MHZ1 = ARVP:FA-238
C1-C7 C11 C12 C19 C20 C23 C24 C29 C30 C33 C35 C39 C44-C46 C48 C50-C61 C70-C73 = rcl:C-EU: CAPACITOR, European symbol; SPICEPREFIX: C
C8-C10 = Kondensatoren (rev17a):WCAP-AS5H: WCAP-AS5H Aluminum Electrolytic Capacitors Characteristics Aluminum Electrolytic Capacitor Recommended soldering: Reflow Operating temperature: -40 °C to +105 °C Long life product series Load life:5000 h @ +105 °C Package name and Variant abbreviation: Package: Package: B X C X A = length of the solder pad X width of the solder pad X pitch of the solder pad. <http://katalog.we-online.de/media/images/eisos/WCAP-AS5H_pf2.jpg> Details see: http://katalog.we-online.de/en/pbs/WCAP-AS5H?m Updated by: Yingchun,Shan Updated: 2017-03-16 2017 (C) Wurth Elektronik; WE-NUMBER: 865230340001/10uF
C13-C18 = rcl:C-US: CAPACITOR, American symbol; SPICEPREFIX: C
C21 C22 C36-C38 C40-C43 C47 C49 = resistor:C-EU: CAPACITOR, European symbol
C25-C28 C31 C32 C34 = adafruit:C-US: CAPACITOR, American symbol
CON4 = ARVP:MOLEX_5566-2
D1 D2 = Moira:MBRM120
D4 = diode:BAT54S: Schottky Diodes Pin connection corrected 2011-05-04 Source: Fairchild .. BAT54.pdf
H1-H3 TP1-TP10 = testpad:TP: Test pad
J1-J3 = ARVP:TE_5-1634503-1: BNC CONNECTOR M/A COM www.macom.com distributor Farnell 149-452
JP1 = pinhead:PINHD-1X5: PIN HEADER
JP2 JP3 = pinhead-2:PINHD-1X03: PIN HEADER
JP4 JP7 = pinhead:PINHD-1X2: PIN HEADER
JP5 JP6 = pinhead:PINHD-1X1: PIN HEADER
JP8 = pinhead-2:PINHD-1X02: PIN HEADER
L1 = Moira:LQH5BPN2R2N38L: 2.2uH
L2 = Moira:VLS5045EX-100M: VLS5045EX-100M, TDK 10uH, 445-174843-1-ND
L3 = Moira:VLS5045EX-150M-CA: VLS5045EX-150M-CA, TDK 15uH, 445-175141-1-ND
L4 L5 L7 L8 L11 L12 = resistor:L-US: INDUCTOR, American symbol
LED1 LED2 = led:LED: LED OSRAM: - CHIPLED LG R971, LG N971, LY N971, LG Q971, LY Q971, LO R971, LY R971 LH N974, LH R974 LS Q976, LO Q976, LY Q976 LO Q996 - Hyper CHIPLED LW Q18S LB Q993, LB Q99A, LB R99A - SideLED LS A670, LO A670, LY A670, LG A670, LP A670 LB A673, LV A673, LT A673, LW A673 LH A674 LY A675 LS A676, LA A676, LO A676, LY A676, LW A676 LS A679, LY A679, LG A679 - Hyper Micro SIDELED® LS Y876, LA Y876, LO Y876, LY Y876 LT Y87S - SmartLED LW L88C, LW L88S LB L89C, LB L89S, LG L890 LS L89K, LO L89K, LY L89K LS L896, LA L896, LO L896, LY L896 - TOPLED LS T670, LO T670, LY T670, LG T670, LP T670 LSG T670, LSP T670, LSY T670, LOP T670, LYG T670 LG T671, LOG T671, LSG T671 LB T673, LV T673, LT T673, LW T673 LH T674 LS T676, LA T676, LO T676, LY T676, LB T676, LH T676, LSB T676, LW T676 LB T67C, LV T67C, LT T67C, LS T67K, LO T67K, LY T67K, LW E67C LS E67B, LA E67B, LO E67B, LY E67B, LB E67C, LV E67C, LT E67C LW T67C LS T679, LY T679, LG T679 LS T770, LO T770, LY T770, LG T770, LP T770 LB T773, LV T773, LT T773, LW T773 LH T774 LS E675, LA E675, LY E675, LS T675 LS T776, LA T776, LO T776, LY T776, LB T776 LHGB T686 LT T68C, LB T68C - Hyper Mini TOPLED® LB M676 - Mini TOPLED Santana® LG M470 LS M47K, LO M47K, LY M47K Source: http://www.osram.convergy.de LUXEON: - LUMILED® LXK2-PW12-R00, LXK2-PW12-S00, LXK2-PW14-U00, LXK2-PW14-V00 LXK2-PM12-R00, LXK2-PM12-S00, LXK2-PM14-U00 LXK2-PE12-Q00, LXK2-PE12-R00, LXK2-PE12-S00, LXK2-PE14-T00, LXK2-PE14-U00 LXK2-PB12-K00, LXK2-PB12-L00, LXK2-PB12-M00, LXK2-PB14-N00, LXK2-PB14-P00, LXK2-PB14-Q00 LXK2-PR12-L00, LXK2-PR12-M00, LXK2-PR14-Q00, LXK2-PR14-R00 LXK2-PD12-Q00, LXK2-PD12-R00, LXK2-PD12-S00 LXK2-PH12-R00, LXK2-PH12-S00 LXK2-PL12-P00, LXK2-PL12-Q00, LXK2-PL12-R00 Source: www.luxeon.com KINGBRIGHT: KA-3528ASYC Source: www.kingbright.com
R1 R1A1 R1A2 R1B1 R1C1 R1D1 R1D2 R2 R2A1 R2A2 R2B1 R2C1 R2D1 R2D2 R3 R3A1 R3A2 R3B1 R3C1 R3D1 R3D2 R4-R19 R28-R34 RCLK1 RCLK2 = rcl:R-US_: RESISTOR, American symbol; SPICEPREFIX: R
R20-R27 = adafruit:R-US_: RESISTOR, American symbol
R35 = ARVP:RCT-0C: 0805 PROBE PAD; COMMENT: 1625854-2; DESCRIPTION: 0805 PROBE PAD; DIGI-KEY_PART_NUMBER: A106144CT-ND; DIGI-KEY_PURCHASE_URL: https://www.digikey.ca/product-detail/en/te-connectivity-amp-connectors/RCT-0C/A106144CT-ND/3477801?utm_source=snapeda&utm_medium=aggregator&utm_campaign=symbol; EU_ROHS_COMPLIANCE: Compliant; MF: TE Connectivity; MP: RCT-0C; PACKAGE: 0805; POWER_RATING: 0 W; RESISTANCE: <.05; TE_PURCHASE_URL: https://www.te.com/usa-en/product-1625854-2.html?te_bu=Cor&te_type=disp&te_campaign=seda_glo_cor-seda-global-disp-prtnr-fy19-seda-model-bom-cta_sma-317_1&elqCampaignId=32493; TOLERANCE: 0%
U1 = Teensy_3_Series_Board_v1.0:TEENSY_3.1_BASIC: Footprint for Teensy 3.1 board using all pin connections on the outer perimeter
U2 = ARVP:LTC6242IGNPBF
U3 U5 = ARVP:MCP1501
U4 = ARVP:AP7331-20WG-7
U6 = LTC6241:LTC6241
U7 U12 U13 = Amplifier-Sonar-LBR:AD8336ACPZ-R7; MANUFACTURER_PART_NUMBER: AD8336ACPZR7; VENDOR: Analog Devices Inc
U8 = Moira:LT3471: LT3471EDD#TRPBF
U9 = Moira:LT1175: LT1175IS8#PBF
U10 = Moira:LT1117-5
U11 = MMBT3904:MMBT3904
U14-U16 = hotfix:LTC6240
U18 = Amplifier-Sonar-Prototype-LBR:ISL21080DIH309Z-TK; MANUFACTURER_PART_NUMBER: ISL21080DIH309ZTK; VENDOR: Intersil
U$6 U$7 = ARVP:LTC1264
U$8 = ARVP:SI5351A

## Net classes
1 net1: clearance 0.203 mm to class 0

## Board
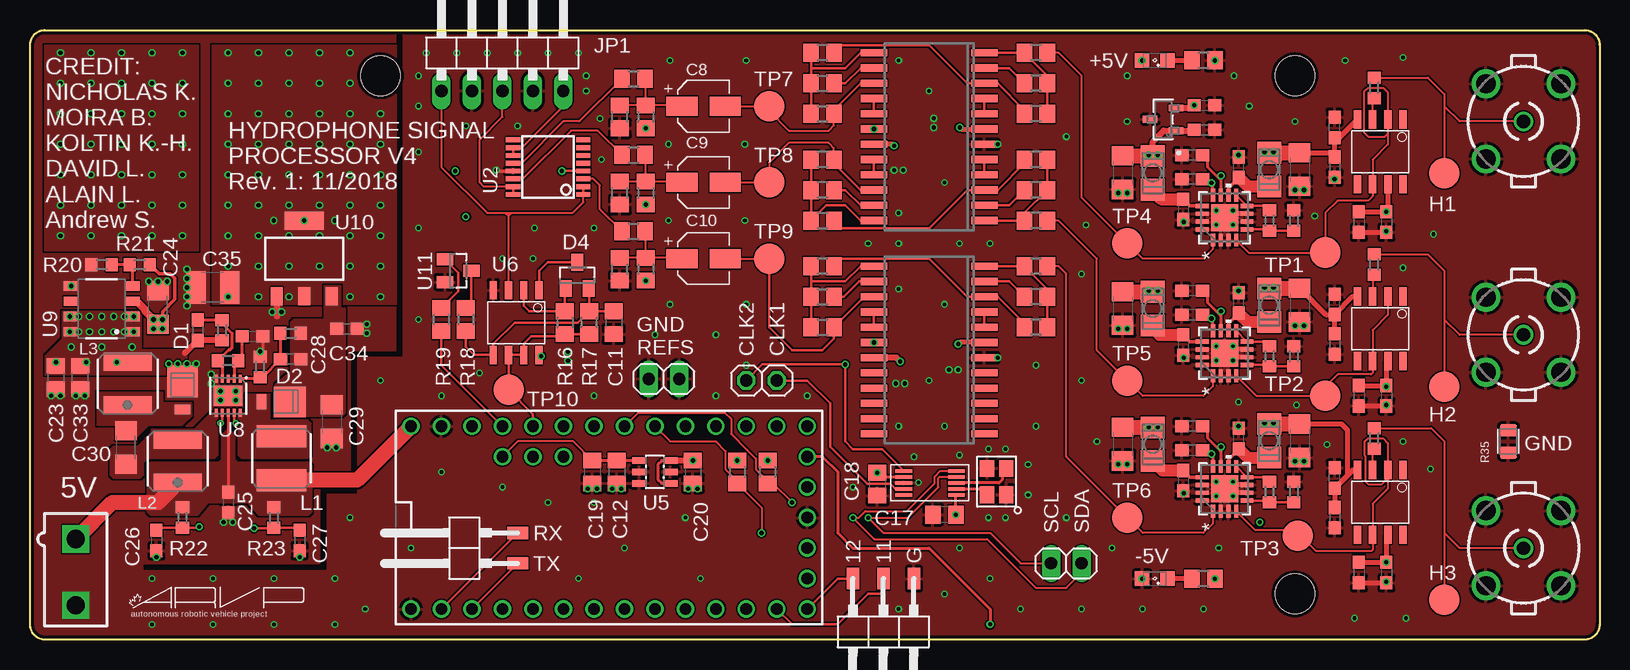
[diagram p7: board, top side]
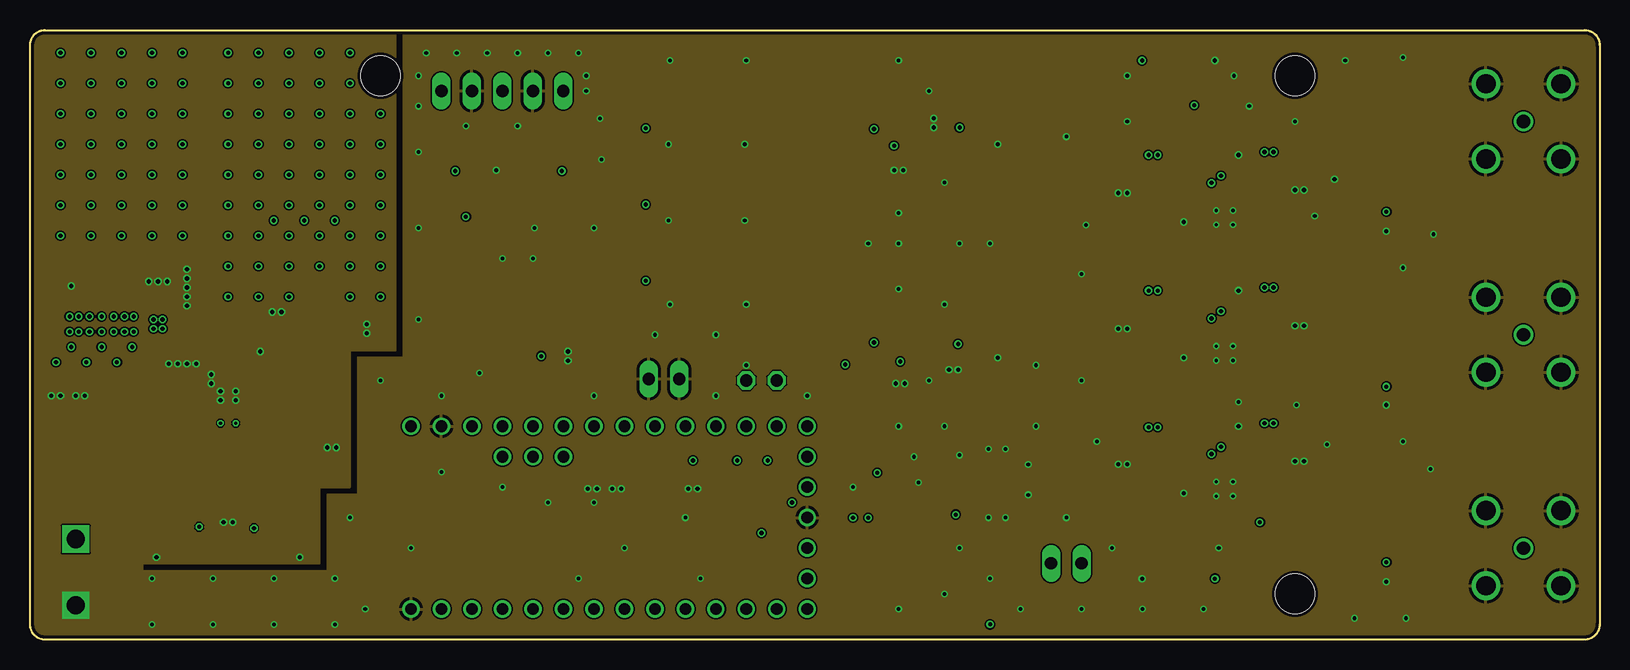
[diagram p8: board, inner layer Route2]
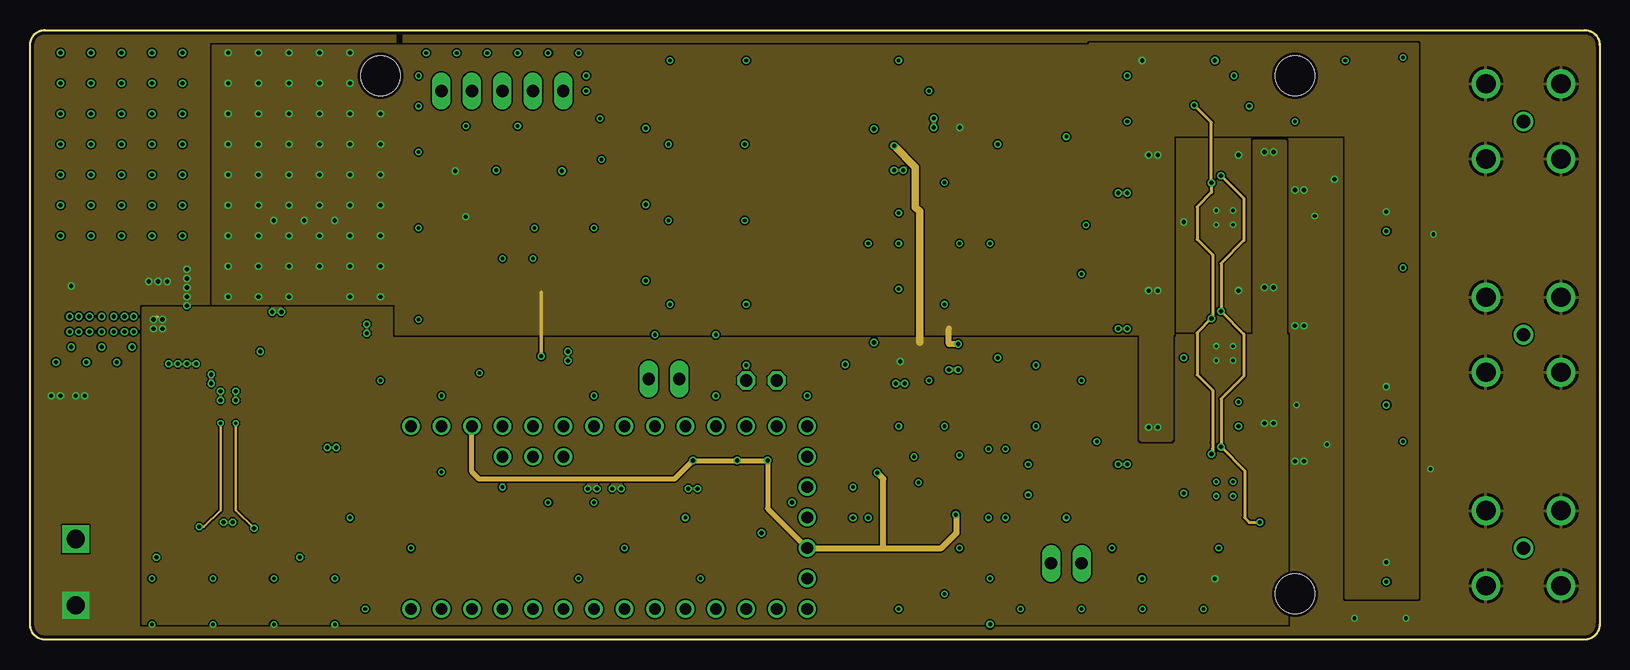
[diagram p9: board, inner layer Route15]
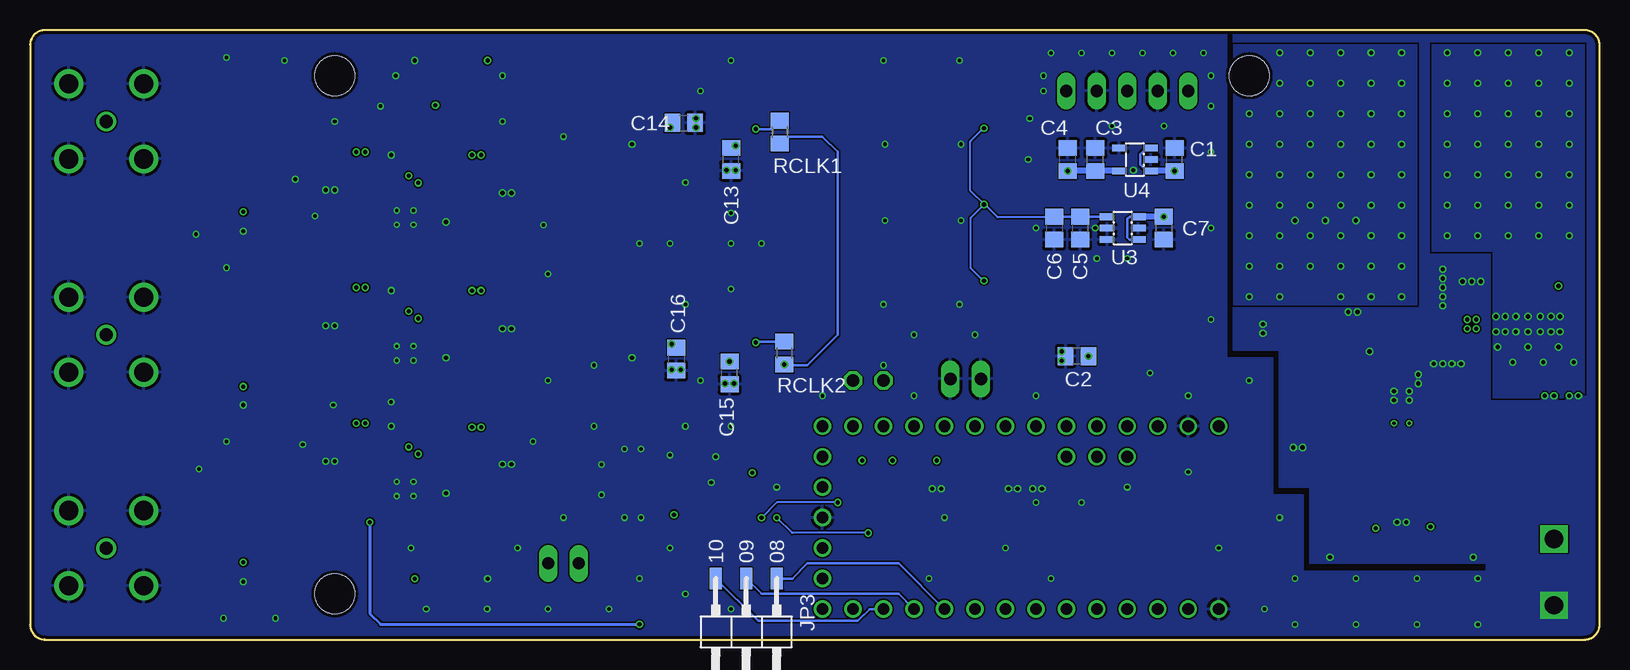
[diagram p10: board, bottom side, seen from below]

Size 130.81 x 50.8 mm. Coordinates in mm from the lower left corner, seen from the top.
Outline: 130.81,49.53 130.81,1.27 arc-90 129.54,0 1.27,0 arc-90 0,1.27 0,49.53 arc-90 1.27,50.8 129.54,50.8 arc-90 130.81,49.53
Copper layers (1*2*15*16): Top 0.035mm / dielectric 0.1702mm / Route2 0.0175mm / dielectric 47mil / Route15 0.0175mm / dielectric 0.1702mm / Bottom 0.035mm
Design rules "OSHPark4Layer": minimum track width 6mil, minimum drill 10mil, track to track 5mil, track to pad 5mil, pad to pad 5mil, via to via 5mil, smd to smd 0mil, copper to edge 10mil, drill to drill 10mil, minimum pad ring 5mil, minimum via ring 5mil, stop-mask expansion 2mil, vias tented up to drill 100mil, thermal gap 10mil
Milling: 8 lines

### Footprints (pad centres in the part's own frame; a part is rotated, then mirrored left to right if it is on the bottom)
FA-238 = smd 1.4 x 1.2: P$1 0,-1.6; P$2 2.2,-1.6; P$3 2.2,0; P$4 0,0
C0805 = smd 1.3 x 1.5: 1 -0.95,0; 2 0.95,0
2.6X1.6X1(BXCXA) = smd 2.6 x 1.6: 1 1.8,0; 2 -1.8,0
C0603 = smd 1.1 x 1: 1 -0.85,0; 2 0.85,0
C1206 = smd 1.6 x 1.8: 1 -1.4,0; 2 1.4,0
C1210 = smd 1.6 x 2.7: 1 -1.4,0; 2 1.4,0
5566-2 = drill 1.524 square: 1 0,-2.756; 2 0,2.756
DO-216AA = smd 2.67 x 2.54: P$1 -0.699,0 | smd 0.8 x 1.27: P$2 1.653,0
SOT23 = smd 1 x 1.4: 1 -0.95,-1.1; 2 0.95,-1.1; 3 0,1.1
B2,54 = smd 2.54 x 2.54: TP 0,0
TE_5-1634503-1 = drill 1.1: 1 0,0 | drill 1.6: 2 3.13,3.13; 3 -3.13,3.13; 4 -3.13,-3.13; 5 3.13,-3.13
1X05/90 = drill 1.016 long: 1 -5.08,-3.81; 2 -2.54,-3.81; 3 0,-3.81; 4 2.54,-3.81; 5 5.08,-3.81
1X03SMD/90 = smd 1.016 x 1.778: 1 -1.27,-5.08; 2 1.27,-5.08; 3 3.81,-5.08
1X02 = drill 1.016 long: 1 -1.27,0; 2 1.27,0
1X01 = drill 1.016 octagon: 1 0,0
1X02SMD/90 = smd 1.016 x 1.778: 1 -1.27,-5.08; 2 1.27,-5.08
NS4.9X4.9 = smd 1.85 x 4.1: P$1 -1.825,0; P$2 1.825,0
NS5X5 = smd 1.5 x 4: P$1 -1.8,0; P$2 1.8,0
L3225P = smd 1.8 x 2: 1 -1.4,0; 2 1.4,0
SML0805 = smd 1.2 x 1.2: A 1.05,0; C -1.05,0
R0805 = smd 1.3 x 1.5: 1 -0.95,0; 2 0.95,0
R0603 = smd 1 x 1.1: 1 -0.85,0; 2 0.85,0
RESC2012X65N = smd 1 x 1.42: 1 -0.935,0; 2 0.935,0
TEENSY_3.1_BASIC = drill 0.965: 0 -7.62,13.97; 1 -7.62,11.43; 2 -7.62,8.89; 3 -7.62,6.35; 3.3V 7.62,11.43; 3.3V1 -2.54,-16.51; 4 -7.62,3.81; 5 -7.62,1.27; 6 -7.62,-1.27; 7 -7.62,-3.81; 8 -7.62,-6.35; 9 -7.62,-8.89; 10 -7.62,-11.43; 11 -7.62,-13.97; 12 -7.62,-16.51; 13 7.62,-16.51; 14/A0 7.62,-13.97; 15/A1 7.62,-11.43; 16/A2 7.62,-8.89; 17/A3 7.62,-6.35; 18/A4 7.62,-3.81; 19/A5 7.62,-1.27; 20/A6 7.62,1.27; 21/A7 7.62,3.81; 22/A8 7.62,6.35; 23/A9 7.62,8.89; A10 5.08,6.35; A11 5.08,3.81; A14 5.08,-16.51; AGND 7.62,13.97; AREF 5.08,8.89; GND -7.62,16.51; GND1 0,-16.51; PGM 2.54,-16.51; VBAT -5.08,-16.51; VIN 7.62,16.51
SSOP16 = smd 0.4 x 1.2: 1 -2.275,-2.925; 2 -1.625,-2.925; 3 -0.975,-2.925; 4 -0.325,-2.925; 5 0.325,-2.925; 6 0.975,-2.925; 7 1.625,-2.925; 8 2.275,-2.925; 9 2.275,2.925; 10 1.625,2.925; 11 0.975,2.925; 12 0.325,2.925; 13 -0.325,2.925; 14 -0.975,2.925; 15 -1.625,2.925; 16 -2.275,2.925
SOT23-6 = smd 0.55 x 1.2: 1 -0.95,-1.3; 2 0,-1.3; 3 0.95,-1.3; 4 0.95,1.3; 5 0,1.3; 6 -0.95,1.3
SOT23-5 = smd 0.55 x 1.2: 1 -0.95,-1.3; 2 0,-1.3; 3 0.95,-1.3; 4 0.95,1.3; 5 -0.95,1.3
SO-8 = smd 1.524 x 0.61: 1 -2.692,1.905; 2 -2.692,0.635; 3 -2.692,-0.635; 4 -2.692,-1.905; 5 2.692,-1.905; 6 2.692,-0.635; 7 2.692,0.635; 8 2.692,1.905
CP_16_4 = smd 2.261 x 2.261: GND1 0,0 | smd 1.067 x 0.356: GNEG 1.865,0.975; GPOS 1.865,0.325; INPP -1.865,-0.975; PWRA -1.865,0.325; VCOM -1.865,-0.325; VGAI 1.865,-0.975; VNEG 1.865,-0.325; VOUT -1.865,0.975 | smd 0.356 x 1.067: INPN -0.975,-1.865; NC 0.325,-1.865; NC1 -0.325,-1.865; NC2 0.325,1.865; NC3 -0.325,1.865; NC4 -0.975,1.865; PRAO 0.975,-1.865; VPOS 0.975,1.865
10-WFDFN = smd 0.675 x 0.25: P$1 -1.413,1; P$2 -1.413,0.5; P$3 -1.413,0; P$4 -1.413,-0.5; P$5 -1.413,-1; P$6 1.413,-1; P$7 1.413,-0.5; P$8 1.413,0; P$9 1.413,0.5; P$10 1.413,1 | smd 1.65 x 2.38: P$11 0,0
8-SOIC = smd 1.143 x 0.762: P$1 -2.603,1.905; P$2 -2.603,0.635; P$3 -2.603,-0.635; P$4 -2.603,-1.905; P$5 2.603,-1.905; P$6 2.603,-0.635; P$7 2.603,0.635; P$8 2.603,1.905
SOT233-3 = smd 0.991 x 1.499: P$1 -2.286,-3.15; P$2 0,-3.15; P$3 2.286,-3.15 | smd 3.277 x 1.499: P$4 0,3.15
P3_064 = smd 0.559 x 1.194: 1 -0.95,-1.079; 2 0.95,-1.079; 3 0,1.079
STAND-OFF = hole 3.302: 0,0
SO24W = smd 0.6 x 2.2: 1 -6.985,-4.6; 2 -5.715,-4.6; 3 -4.445,-4.6; 4 -3.175,-4.6; 5 -1.905,-4.6; 6 -0.635,-4.6; 7 0.635,-4.6; 8 1.905,-4.6; 9 3.175,-4.6; 10 4.445,-4.6; 11 5.715,-4.6; 12 6.985,-4.6; 13 6.985,4.6; 14 5.715,4.6; 15 4.445,4.6; 16 3.175,4.6; 17 1.905,4.6; 18 0.635,4.6; 19 -0.635,4.6; 20 -1.905,4.6; 21 -3.175,4.6; 22 -4.445,4.6; 23 -5.715,4.6; 24 -6.985,4.6
MSOP-10 = smd 1.4 x 0.3: P$1 0,0; P$2 0,-0.5; P$3 0,-1; P$4 0,-1.5; P$5 0,-2; P$6 4.4,-2; P$7 4.4,-1.5; P$8 4.4,-1; P$9 4.4,-0.5; P$10 4.4,0

### Placement (x,y rotation side)
25MHZ1  79.76,12.06 90 top
C1  35.43,40.01 90 bottom
C2  43.56,23.62 180 bottom
C3  42.04,40.01 90 bottom
C4  44.32,40.01 90 bottom
C5  43.31,34.29 270 bottom
C6  45.47,34.29 270 bottom
C7  36.32,34.29 270 bottom
C8  56.13,44.45 180 top
C9  56.13,38.1 180 top
C10  56.13,31.75 180 top
C11  48.64,26.42 270 top
C12  48.89,13.97 270 top
C13  72.39,40.01 90 bottom
C14  76.33,43.05 0 bottom
C15  72.52,22.23 90 bottom
C16  76.96,23.37 270 bottom
C17  76.2,10.41 180 top
C18  70.61,12.95 270 top
C19  46.86,13.97 270 top
C20  55.25,13.97 270 top
C21  100.74,39.36 90 top
C22  105.8,39.17 270 top
C23  2.16,21.84 270 top
C24  10.67,27.69 90 top
C25  16.51,11.43 270 top
C26  10.54,8.26 270 top
C27  22.48,8.26 270 top
C28  21.72,23.37 180 top
C29  25.15,18.16 270 top
C30  8,16 90 top
C31  18.54,25.27 0 top
C32  13.97,25.78 270 top
C33  4.19,21.84 90 top
C34  26.42,25.91 0 top
C35  15.24,29.34 180 top
C36  96.1,35.85 270 top
C37  91.05,38.91 270 top
C38  96.85,38.36 180 top
C39  96.85,40.38 180 top
C40  100.74,28.06 90 top
C41  105.8,27.87 270 top
C42  96.1,24.55 270 top
C43  91.05,27.59 270 top
C44  96.85,27.06 180 top
C45  96.85,29.08 180 top
C46  100.74,16.76 90 top
C47  105.8,16.57 270 top
C48  96.1,13.25 270 top
C49  91.06,16.29 270 top
C50  108.71,13.46 90 top
C51  108.71,10.16 270 top
C52  110.74,5.59 270 top
C53  113.03,5.59 270 top
C54  108.71,27.94 90 top
C55  108.71,24.64 270 top
C56  110.74,20.32 270 top
C57  113.03,20.32 270 top
C58  108.71,42.67 90 top
C59  108.71,39.37 270 top
C60  110.74,34.8 270 top
C61  113.03,34.8 270 top
C70  96.85,15.76 180 top
C71  96.85,17.78 180 top
C72  97.88,42.48 0 top
C73  97.88,44.53 0 top
CON4  3.81,5.62 180 top
D1  12.7,20.83 270 top
D2  20.95,19.81 180 top
D4  45.59,30.35 0 top
H1  117.86,38.86 90 top
H2  117.86,21.08 90 top
H3  117.86,3.3 90 top
J1  124.46,43.18 90 top
J2  124.46,25.4 90 top
J3  124.46,7.62 270 top
JP1  39.37,49.53 0 top
JP2  72.39,0 180 top
JP3  69.85,0 180 bottom
JP4  52.83,21.72 180 top
JP5  62.23,21.59 0 top
JP6  59.69,21.59 0 top
JP7  86.36,6.35 180 top
JP8  35.56,7.62 90 top
L1  20.95,15.11 90 top
L2  12.32,14.86 90 top
L3  8.13,21.34 90 top
L4  103.27,39.17 90 top
L5  93.58,38.89 90 top
L7  103.27,27.87 90 top
L8  93.58,27.59 90 top
L11  103.27,16.57 90 top
L12  93.58,16.29 90 top
LED1  93.73,48.26 180 top
LED2  93.73,5.08 180 top
R1  51.31,43.56 270 top
R1A1  83.82,48.9 180 top
R1A2  83.82,31.12 180 top
R1B1  83.82,34.92 180 top
R1C1  66.04,34.92 0 top
R1D1  66.04,48.9 180 top
R1D2  66.04,31.12 180 top
R2  49.15,43.56 90 top
R2A1  83.82,46.36 180 top
R2A2  83.82,28.58 180 top
R2B1  83.82,37.47 180 top
R2C1  66.04,37.47 180 top
R2D1  66.04,46.36 0 top
R2D2  66.04,28.58 0 top
R3  58.93,13.97 270 top
R3A1  83.82,43.81 180 top
R3A2  83.82,26.04 180 top
R3B1  83.82,40.01 180 top
R3C1  66.04,40.01 180 top
R3D1  66.04,43.81 0 top
R3D2  66.04,26.04 0 top
R4  61.47,13.97 270 top
R5  50.29,46.74 0 top
R6  51.31,37.21 270 top
R7  49.15,37.21 90 top
R8  50.29,40.39 0 top
R9  51.31,30.86 270 top
R10  49.15,30.86 90 top
R11  50.29,34.04 0 top
R12  103.3,34.92 270 top
R13  105.32,34.92 90 top
R14  103.3,23.62 270 top
R15  105.32,23.62 90 top
R16  44.58,26.42 270 top
R17  46.61,26.42 90 top
R18  36.32,26.67 270 top
R19  34.29,26.67 90 top
R20  5.97,31.24 0 top
R21  9.14,31.24 0 top
R22  12.7,10.16 90 top
R23  20.32,10.16 90 top
R24  21.72,25.53 0 top
R25  19.18,22.73 270 top
R26  16,25.78 90 top
R27  16.51,23.24 0 top
R28  103.3,12.32 270 top
R29  105.32,12.32 90 top
R30  97.79,48.26 180 top
R31  97.79,5.08 180 top
R32  112.01,16.76 270 top
R33  112.01,31.24 270 top
R34  112.01,45.97 270 top
R35  123.19,16.51 90 top
RCLK1  68.33,42.29 270 bottom
RCLK2  67.95,23.88 270 bottom
TP1  107.95,32.26 0 top
TP2  107.95,20.32 0 top
TP3  105.66,8.64 0 top
TP4  91.44,33.02 0 top
TP5  91.44,21.59 0 top
TP6  91.44,10.16 0 top
TP7  61.6,44.45 0 top
TP8  61.6,38.1 0 top
TP9  61.6,31.75 0 top
TP10  39.88,20.83 0 top
U1  48.26,10.16 90 top
U2  43.18,39.37 90 top
U3  39.75,34.29 270 bottom
U4  38.73,40.01 90 bottom
U5  52.07,13.97 270 top
U6  40.51,26.42 270 top
U7  99.55,35.16 90 top
U8  16.51,20.32 270 top
U9  5.97,27.56 180 top
U10  22.86,31.75 0 top
U11  35.69,30.73 270 top
U12  99.55,23.86 90 top
U13  99.55,12.56 90 top
U14  112.52,11.43 270 top
U15  112.52,25.91 270 top
U16  112.52,40.64 270 top
U18  94.42,43.36 90 top
U$1  [A4L-LOC]  -68.58,-64.77 0 top  (outside the outline)
U$2  [STAND-OFF]  105.41,3.81 0 top
U$3  [STAND-OFF]  105.41,46.99 0 top
U$4  [ARVP]  8.38,1.91 0 top
U$5  [STAND-OFF]  29.21,46.99 0 top
U$6  74.93,41.91 90 top
U$7  74.93,24.13 90 top
U$8  77.22,12.06 180 top

### Tracks (layer width: path | path; a pad name or v marks a point on that pad's centre or on a via)
2V5_REF
  Top 0.152: C19.1 45.27,16.51 40.64,16.51 U1.AREF
  Top 0.254: U5.1 C12.1 C19.1
2V_REF  (via drill 0.35)
  Bottom 0.152: R6.2 51.25,36.26 50.17,35.18 45.53,35.18 C6.1 | R6.2 52.45,37.4 52.45,41.53 51.37,42.61 R1.2 | R6.2 52.45,35.12 52.45,30.99 51.37,29.91 R9.2
  Bottom 0.203: U3.1 C5.1 C6.1
  other vias: 51.31,36.26 51.31,29.91 51.31,42.61
7.5V
  pour Top (no thermals): 20.45,18.67 26.03,18.67 26.29,18.92 26.29,27.56 25.91,27.56 25.91,29.46 24.51,29.46 24.51,26.67 21.97,26.67 21.72,26.42 21.72,22.35 21.34,21.97 20.45,21.21
+2V  (via drill 0.35)
  Top 0.203: C4.1 46.09,39.06 U2.4
  Bottom 0.508: C4.1 C3.1 U4.5
  other vias: 44.32,39.06
+3V3  (via drill 0.35)
  Top 0.254: C18.1 70.95,13.56 U$8.P$7 | C17.1 77.15,12 U$8.P$1 | U5.6 52.64,14.92 52.32,14.61 52.32,13.34 52.64,13.02 U5.4
  Top 0.508: C20.1 U5.6
  Route15 0.406: U1.3.3V 36.83,13.97 37.4,13.4 53.73,13.4 C20.1 R3.1 R4.1 61.47,10.92 U1.3.3V1
  Route15 0.508: U1.3.3V1 71.12,7.62 | 71.12,7.62 75.95,7.62 77.22,8.89 77.22,10.35 C17.1 | 71.12,7.62 71.12,13.4 C18.1
  other vias: 61.47,14.92 58.93,14.92 70.61,13.9 77.15,10.41 55.25,14.92
+5V  (via drill 0.35)
  Top 0.152: L12.2 v93.22,17.69 | L8.2 93.22,29.35 v93.22,29.08 | L5.2 93.58,40.11 v93.22,40.39
  Top 0.203: U6.8 42.52,23.62 C2.1
  Top 0.406: v77.47,42.67 77.6,42.55 U$6.7 | U$7.7 77.47,24.77 v77.34,24.64 | C60.1 C61.1 113.16,35.78 U16.7 | C56.1 112.94,21.17 v113.03,21.08 C57.1 113.03,23.09 U15.7 | C52.1 C53.1 113.03,8.61 U14.7
  Top 0.508: C72.1 96.83,42.41 U18.1 94.48,42.41 93.58,41.51 L5.2
  Top 1.27: C49.1 v93.22,17.69 | C43.1 93.83,28.99 L8.2 | C37.1 93.81,40.31 L5.2
  Route15 0.305: 42.61,28.95 C2.1
  Route15 0.508: v77.34,24.64 76.58,24.64 76.58,25.91
  Bottom 0.203: U4.1 37.78,39.06 38.29,39.56 38.29,40.45 37.78,40.95 U4.3 | U3.6 39.18,35.24 39.37,35.05 39.37,33.53 39.18,33.34 U3.4
  Bottom 0.406: C16.1 77.02,24.32 v77.34,24.64 | C14.1 77.28,42.87 v77.47,42.67
  Bottom 0.508: C1.1 U4.1 | C7.1 U3.6
  other vias: 26.67,41.28 24.13,38.73 21.59,38.73 19.05,38.73 16.51,38.73 16.51,36.2 19.05,36.2 21.59,36.2 24.13,36.2 26.67,36.2 16.51,33.66 19.05,33.66 21.59,33.66 24.13,33.66 26.67,33.66 16.51,31.12 19.05,31.12 21.59,31.12 24.13,31.12 26.67,31.12 26.67,38.73 24.13,41.28 21.59,41.28 19.05,41.28 16.51,41.28 26.67,43.81 24.13,43.81 21.59,43.81 19.05,43.81 16.51,43.81 24.13,48.9 21.59,48.9 19.05,48.9 16.51,48.9 24.13,46.36 21.59,46.36 19.05,46.36 16.51,46.36 16.51,28.58 19.05,28.58 26.67,28.58 26.67,46.36 26.67,48.9 29.21,43.81 29.21,41.28 29.21,38.73 21.59,28.58 29.21,36.2 29.21,33.66 29.21,31.12 29.21,28.58 22.86,34.92 20.32,34.92 25.4,34.92 35.43,39.06 36.32,35.24 42.61,23.62 93.98,17.69 93.98,29.08 93.98,40.39 92.68,48.26 113.03,35.65 113.03,6.44
  pour Top (rank 2, no thermals): 30.48,49.53 30.48,27.94 15.24,27.94 15.24,49.53
  pour Bottom (rank 2, no thermals): 30.48,49.53 30.48,27.94 15.24,27.94 15.24,49.53
  pour Route15: 15.24,49.53 95.25,49.53 95.25,25.4 30.48,25.4 30.48,27.94 15.24,27.94
  pour Route15 (no thermals): 92.65,41.66 95.05,41.66 95.05,16.66 92.65,16.66
  pour Route15: 88.39,49.53 88.39,42.16 109.73,42.16 109.73,3.56 115.57,3.56 115.57,49.53
-5V  (via drill 0.35)
  Top 0.152: L4.2 103.27,40.37 v103.63,40.64 | L11.2 102.95,18.29 v102.87,18.03 | L7.2 102.95,29.59 v102.87,29.34 | 109.11,41.82 C58.1
  Top 0.305: R21.2 10.76,30.48 11.69,30.48 12.06,30.11 12.06,28.35 11.05,27.34 v11.05,26.67 | C24.1 v11.05,25.91 | 108.5,40.43 C59.1
  Top 0.406: v72.01,41.15 71.88,41.28 U$6.19 | U16.4 109.11,41.82 | C22.1 108.5,40.57 108.5,40.43 | C59.1 C58.1 | C41.1 107.98,27.09 C54.1 | C54.1 110.22,28.6 U15.4 | C55.1 C54.1 | C51.1 C50.1 109.77,13.67 | 109.77,13.67 110.22,14.12 U14.4 | C47.1 109.28,17.97 109.77,17.48 109.77,13.67
  Top 0.508: v72.52,23.17 72.2,23.5 U$7.19
  Top 0.61: C24.1 9.6,27.35 9.6,27.49 8.9,28.19 U9.P$3
  Top 1.27: L7.2 C41.1 | L4.2 C22.1 | L11.2 C47.1
  Route15 0.152: 10.54,26.92 10.67,26.92
  Route15 0.61: v72.01,41.15 73.79,39.37 73.79,36.04 74.14,35.68 74.14,24.79
  Bottom 0.406: C13.2 72.33,40.83 v72.01,41.15
  other vias: 10.29,25.91 10.29,26.67 102.87,40.64 103.63,18.03 103.63,29.34 98.74,5.08
  pour Route15 (rank 2): 9.4,1.27 9.4,27.69 30.48,27.69 30.48,25.4 104.77,25.4 104.77,1.27
  pour Route15 (no thermals): 102.05,16.96 104.55,16.96 104.55,41.46 102.05,41.46
-7.5V  (via drill 0.35)
  Top 0.508: R26.1 C32.2 12.92,23.88
  other vias: 12.7,36.2 10.16,36.2 7.62,36.2 5.08,36.2 2.54,36.2 2.54,33.66 5.08,33.66 7.62,33.66 10.16,33.66 12.7,33.66 12.7,38.73 10.16,38.73 7.62,38.73 5.08,38.73 2.54,38.73 12.7,41.28 10.16,41.28 7.62,41.28 5.08,41.28 2.54,41.28 7.87,25.65 7.87,26.92 4.06,26.92 4.06,25.65 8.64,25.65 8.64,26.92 3.3,26.92 3.3,25.65 6.98,25.65 6.98,26.92 5.97,26.92 5.97,25.65 4.95,25.65 4.95,26.92 12.7,43.81 10.16,43.81 7.62,43.81 5.08,43.81 2.54,43.81 12.7,46.36 10.16,46.36 7.62,46.36 5.08,46.36 2.54,46.36 5.97,24.38 4.7,23.11 3.43,24.38 2.16,23.11 7.24,23.11 8.51,24.38 12.7,48.9 10.16,48.9 7.62,48.9 5.08,48.9 2.54,48.9
  pour Top (no thermals): 1.27,23.62 1.27,22.1 13.08,22.1 13.08,24.13 9.27,24.13 9.27,27.31 2.67,27.31 2.67,25.02
  pour Bottom (rank 2, no thermals): 13.97,49.53 13.97,32.39 8.89,32.39 8.89,22.1 1.27,22.1 1.27,49.53
  pour Top (rank 2, no thermals): 13.97,49.53 13.97,32.39 1.27,32.39 1.27,49.53
  pour Bottom (rank 2, no thermals): 13.97,49.53 13.97,32.39 8.89,32.39 8.89,20.19 1.27,20.19 1.27,49.53
AMP_1
  Top 0.152: R1A1.1 85.73,48.9 87.63,46.99 87.63,36.83 TP4.TP 92.71,31.75 97.79,31.75 98.58,32.54 U7.VOUT
AMP_2
  Top 0.152: R1B1.1 85.73,34.92 88.9,31.75 88.9,24.13 TP5.TP 92.71,20.32 97.79,20.32 98.58,21.11 U12.VOUT
AMP_3
  Top 0.152: R1A2.1 85.73,31.12 86.36,30.48 86.36,15.24 TP6.TP 92.71,8.89 97.79,8.89 98.58,9.67 U13.VOUT
BIASED_0
  Top 0.152: R1.1 R2.2 | C8.1 54.27,44.51 R1.1 | R1.1 51.31,46.67 R5.2
BIASED_1
  Top 0.152: R6.1 R7.2 | C9.1 54.27,38.16 R6.1 | R6.1 51.31,40.32 R8.2
BIASED_2
  Top 0.152: R9.1 R10.2 | C10.1 54.27,31.81 R9.1 | R9.1 51.31,33.97 R11.2
CLAMP_IN_0
  Top 0.152: R5.1 45.79,43.18 44.45,43.18 40.97,39.7 U2.12
CLAMP_IN_1
  Top 0.152: R8.1 47.31,42.42 45.09,42.42 41.06,38.4 U2.14
CLAMP_IN_2
  Top 0.152: R11.1 47.5,35.88 47.5,37.85 46.95,38.4 U2.3
CLK1
  Top 0.203: JP5.1 64.77,21.59 66.68,19.68 66.68,16.08 69.76,13 71.67,13 72.11,12.56 U$8.P$9
CLK2  (via drill 0.35)
  Top 0.203: U$8.P$6 71.01,15.88 68.58,15.88 67.95,16.51 RCLK2.2 61.03,22.93 JP6.1
  Bottom 0.203: RCLK2.2 67.88,22.86 66.04,22.86 63.5,25.4 63.5,40.64 64.77,41.91 67.56,41.91 68.13,41.34 RCLK1.2
  other vias: 67.95,22.93
FILTER_OUT_1
  Top 0.152: C8.2 TP7.TP 61.6,44.07 63.25,42.42 66.55,42.42 66.99,42.86 R3D1.2
  Top 0.203: U$6.15 69.21,46.36 66.99,44.13 R3D1.2
FILTER_OUT_2
  Top 0.152: C9.2 TP8.TP 61.6,39.75 63.25,41.4 66.55,41.4 66.99,40.96 R3C1.1
  Top 0.203: U$6.22 69.21,37.47 66.99,39.69 R3C1.1
FILTER_OUT_3
  Top 0.152: C10.2 TP9.TP
  Top 0.203: U$7.15 69.53,28.58 R3D2.2 66.99,25.08 66.04,24.13 63.5,24.13 61.6,26.04 TP9.TP
GAIN_NEG  (via drill 0.35)
  Top 0.254: U13.GNEG 98.58,15.34 v98.45,15.46 98.15,15.76 C70.1 | U12.GNEG 98.58,26.64 v98.45,26.76 98.15,27.06 C44.1 | U7.GNEG 98.58,37.94 v98.45,38.06 98.15,38.36 C38.1
  Top 0.508: U18.2 96.68,44.31 C73.1
  Route15 0.254: v98.45,15.46 98.55,15.56 98.55,15.9 98.54,15.91 98.54,16.41 98.55,16.42 98.55,20.76 97.25,22.06 97.25,25.56 v98.45,26.76 98.55,26.86 98.55,32.06 97.25,33.36 97.25,36.06 98.45,37.26 v98.45,38.06 98.45,43.11 C73.1
  other vias: 97.03,44.53
GAIN_POS  (via drill 0.35)
  Top 0.254: U1.A14 66.04,15.24 67.31,13.97 67.31,8.89 68.58,7.62 74.93,7.62 80.01,2.54 v80.01,1.27 | 99.23,38.29 U7.GPOS | C39.1 98.15,40.34 98.15,39.36 99.23,38.29 | 99.23,26.98 U12.GPOS | C45.1 98.15,29.04 98.15,28.06 99.23,26.98 | 99.23,15.69 U13.GPOS | C71.1 98.15,17.74 98.15,16.76 99.23,15.69 | 99.23,16.04 99.23,15.69 | 99.23,27.34 99.23,26.98 | 99.23,38.64 99.23,38.29
  Top 0.406: v99.25,16.06 99.23,16.04 | v99.25,27.36 99.23,27.34 | v99.25,38.66 99.23,38.64
  Route15 0.254: v99.25,38.66 101.15,36.76 101.15,33.26 99.25,31.36 v99.25,27.36 101.15,25.46 101.15,21.96 99.25,20.06 v99.25,16.06 101.22,14.09 101.22,10.16 101.6,9.78 v102.49,9.78
  Bottom 0.254: v102.49,9.78 102.49,2.16 101.6,1.27 v80.01,1.27
GND  (via drill 0.26, 0.3, 0.35)
  Top 0.152: 99.88,35.48 U7.GND1 | 99.88,23.54 U12.GND1 99.88,24.19 | 99.88,12.23 99.65,12.46 | 99.65,12.46 U13.GND1 | 99.88,12.89 99.6,12.61 | 99.6,12.61 U13.GND1 | 99.88,12.34 99.6,12.61 | 98.77,11.59 99.65,12.46 | 99.23,12.23 99.5,12.51 | 99.13,12.89 99.5,12.51 | 99.5,12.51 U13.GND1
  Top 0.254: C31.2 19.39,23.8 R25.1 v19.18,24
  Top 0.305: U2.13 38.93,39.05 v38.86,39.12
  Top 0.406: U7.NC 99.88,35.48 | U12.NC1 99.88,23.54 | U12.NC 99.88,24.19 | U13.NC1 99.88,12.23 | U13.NC 99.88,12.89 | C60.2 C61.2 | C56.2 C57.2 | C52.2 C53.2
  Top 0.508: U10.P$1 20.57,26.92
  other vias: 3.81,20.32 16.89,9.78 2.54,20.32 1.78,20.32 25.53,16 12.32,22.99 17.14,19.94 15.88,19.94 13.84,22.99 11.56,22.99 20.95,27.31 13.08,29.34 13.08,28.58 28.07,25.53 17.14,20.7 15.88,20.7 16.13,9.78 24.77,16 28.07,26.29 20.19,27.31 4.57,20.32 13.08,22.99 13.08,30.1 15.11,21.34 10.67,29.84 9.91,29.84 11.43,29.84 15.11,22.1 3.43,29.46 22.48,6.86 10.54,6.86 75.31,42.67 76.58,22.48 13.08,30.86 13.08,27.81 72.14,21.34 80.64,23.5 80.64,41.28 72.01,39.12 44.83,24 44.83,23.24 46.48,12.57 47.24,12.57 48.51,12.57 49.28,12.57 54.86,12.57 55.63,12.57 72.77,39.12 75.31,43.43 72.9,21.34 77.34,22.48 100.33,46.99 101.6,44.45 97.79,2.54 99.06,7.62 87.63,21.59 87.63,30.48 80.01,33.02 69.85,33.02 77.47,33.02 72.39,33.02 86.36,41.91 91.44,43.18 91.44,46.99 87.63,2.54 76.2,3.81 83.82,22.86 83.82,17.78 86.36,10.16 88.01,34.54 105.41,43.18 88.9,16.51 80.01,5.08 59.69,48.26 59.56,41.28 59.56,34.92 59.69,27.94 53.34,48.26 53.21,41.28 53.21,34.92 53.34,27.94 59.69,22.86 64.77,20.32 46.36,46.99 32.39,46.99 32.39,40.64 32.39,34.29 42.04,34.29 39.37,31.75 41.91,31.75 46.99,34.29 47.62,40.01 47.5,43.43 40.64,42.8 36.32,42.8 35.56,48.9 38.1,48.9 40.64,48.9 43.18,48.9 45.72,48.9 33.02,48.9 74.04,13.08 98.85,34.56 98.85,35.76 100.25,35.76 100.25,34.56 98.85,23.26 98.85,24.46 100.25,24.46 100.25,23.26 98.85,11.96 98.85,13.16 100.25,13.16 100.25,11.96 90.68,37.21 91.44,37.21 90.68,25.91 91.44,25.91 90.68,14.61 91.44,14.61 105.41,37.47 106.17,37.47 105.41,26.16 106.17,26.16 105.41,14.86 106.17,14.86 100.71,40.39 96.14,34.8 100.71,29.08 96.14,23.5 100.71,17.78 96.14,12.19 32.39,26.67 29.21,21.59 26.67,10.16 34.29,20.32 46.99,20.32 57.15,20.32 57.15,25.4 76.2,17.78 72.39,29.21 76.2,27.94 74.93,21.59 76.2,38.1 72.39,48.26 74.93,45.72 72.39,35.56 90.17,7.62 72.39,17.78 27.94,2.54 10.16,1.27 15.24,1.27 20.32,1.27 25.4,1.27 10.16,5.08 15.24,5.08 20.32,5.08 25.4,5.08 32.39,44.45 46.36,45.72 83.18,14.61 83.18,12.06 81.28,10.16 79.88,10.16 79.88,15.88 81.28,15.88 77.47,15.37 73.66,15.24 49.53,7.62 46.99,11.43 55.88,5.08 34.29,13.97 98.74,48.26 92.68,5.08 39.37,12.7 31.75,7.62 43.18,11.43 72.39,2.54 77.47,7.62 68.58,12.7 54.61,10.16 92.71,2.54 82.55,2.54 52.07,25.4 45.72,5.08 37.47,22.23 113.03,34.04 113.03,19.56 108.71,38.35 113.03,4.83 116.97,33.78 109.6,48.26 107.06,35.31 114.43,30.99 105.54,19.56 100.71,19.81 114.43,16.51 108.08,16.26 110.36,1.78 114.68,1.78 114.43,48.51 116.71,14.22
  pour Top (no thermals): 17.27,8.51 17.53,8.76 17.53,10.8 17.27,11.05 15.75,11.05 15.49,10.8 15.49,8.76 15.75,8.51
  pour Route15 (rank 5): 27.94,1.27 1.27,1.27 1.27,49.53 30.48,49.53 30.48,3.81 27.94,3.81
  pour Top: 23.37,6.73 23.37,7.75 23.11,8 20.32,8 20.07,7.75 20.07,6.73 20.32,6.48 23.11,6.48
  pour Bottom (rank 4, no thermals): 26.67,12.7 26.67,24.13 30.48,24.13 30.48,49.53 1.27,49.53 1.27,12.7
  pour Top: 12.32,6.48 12.57,6.73 12.57,7.75 12.32,8 9.65,8 9.4,7.75 9.4,6.73 9.65,6.48
  pour Top (rank 2, no thermals): 25.78,16 24.51,16 24.26,16.26 24.51,18.42 26.29,18.42 26.03,16.26
  pour Top (rank 2, no thermals): 28.58,26.54 28.58,25.27 28.32,25.02 26.54,25.02 26.54,26.8 28.32,26.8
  pour Top (rank 4, no thermals): 26.67,12.7 26.67,24.13 30.48,24.13 30.48,49.53 1.27,49.53 1.27,12.7
  pour Route2 (rank 4, no thermals): 26.67,12.7 26.67,24.13 30.48,24.13 30.48,49.53 1.27,49.53 1.27,12.7
  pour Route2 (rank 4): 31.11,50.8 31.11,23.5 27.31,23.5 27.31,12.06 24.77,12.06 24.77,5.72 9.4,5.72 9.4,6.35 24.13,6.35 24.13,12.7 26.67,12.7 26.67,24.13 30.48,24.13 30.48,50.8 1.27,50.8 arc90 0,49.53 0,1.27 arc90 1.27,0 129.54,0 arc90 130.81,1.27 130.81,49.53 arc90 129.54,50.8
  pour Bottom (rank 4): 130.81,49.53 arc90 129.54,50.8 31.11,50.8 31.11,23.5 27.31,23.5 27.31,12.06 24.77,12.06 24.77,5.72 9.4,5.72 9.4,6.35 24.13,6.35 24.13,12.7 26.67,12.7 26.67,24.13 30.48,24.13 30.48,50.8 1.27,50.8 arc90 0,49.53 0,1.27 arc90 1.27,0 129.54,0 arc90 130.81,1.27
  pour Bottom (no thermals): 6.35,5.08 1.27,5.08 1.27,1.27 6.35,1.27
  pour Route15 (no thermals): 6.35,5.08 1.27,5.08 1.27,1.27 6.35,1.27
  pour Route2 (no thermals): 6.35,5.08 1.27,5.08 1.27,1.27 6.35,1.27
  pour Top (no thermals): 6.35,5.08 1.27,5.08 1.27,1.27 6.35,1.27
  pour Top (rank 4): 130.81,49.53 arc90 129.54,50.8 31.11,50.8 31.11,23.5 27.31,23.5 27.31,12.06 24.77,12.06 24.77,5.72 9.4,5.72 9.4,6.35 24.13,6.35 24.13,12.7 26.67,12.7 26.67,24.13 30.48,24.13 30.48,50.8 1.27,50.8 arc90 0,49.53 0,1.27 arc90 1.27,0 129.54,0 arc90 130.81,1.27
  pour Route15 (rank 4): 130.81,49.53 arc90 129.54,50.8 31.11,50.8 31.11,23.5 27.31,23.5 27.31,12.06 24.77,12.06 24.77,5.72 9.4,5.72 9.4,6.35 24.13,6.35 24.13,12.7 26.67,12.7 26.67,24.13 30.48,24.13 30.48,50.8 1.27,50.8 arc90 0,49.53 0,1.27 arc90 1.27,0 129.54,0 arc90 130.81,1.27
  pour Bottom (no thermals): 100.65,34.06 97.75,34.06 97.75,35.66 98.35,36.26 100.65,36.26
  pour Bottom (no thermals): 100.65,22.76 97.75,22.76 97.75,24.36 98.35,24.96 100.65,24.96
  pour Bottom (no thermals): 100.65,11.46 97.75,11.46 97.75,13.06 98.35,13.66 100.65,13.66
GPIO_0
  Bottom 0.203: JP3.1 67.31,5.08 66.04,6.35 58.42,6.35 U1.8
GPIO_1
  Bottom 0.203: JP3.2 69.85,3.81 58.42,3.81 U1.9
GPIO_2
  Bottom 0.203: U1.10 60.85,2.54 61.83,1.56 70.14,1.56 JP3.3
GPIO_3
  Top 0.203: U1.11 63.5,1.27 67.31,1.27 69.85,3.81 70.99,3.81 71.12,3.94 JP2.2
GPIO_4
  Top 0.203: U1.12 67.31,5.08 JP2.3
I2C_SCL  (via drill 0.35)
  Top 0.152: U1.19/A5 50.67,18.92 57.91,18.92 58.42,18.42 58.42,17.15 59.77,15.8 60.49,15.08 60.49,14.17 61.47,13.2 R4.2 61.91,13.02 v63.5,11.43 | U$8.P$4 75.8,13.56 75.69,13.46 75.69,12.7 73.15,10.16 v69.85,10.16 71.12,8.89 80.01,8.89 82.55,6.35 JP7.2
  Bottom 0.152: v63.5,11.43 68.58,11.43 v69.85,10.16
I2C_SDA  (via drill 0.35)
  Top 0.152: U1.18/A4 53.34,16.51 57.15,16.51 57.95,15.71 57.95,14.17 58.93,13.2 R3.2 60.96,10.99 v60.96,8.89 | U$8.P$5 75.86,14.06 75.39,13.59 75.39,13.03 73.07,10.72 69.62,10.72 69.06,10.16 v68.58,10.16 70.36,8.38 79.76,8.38 83.82,4.32 86.36,4.32 87.63,5.59 JP7.1
  Bottom 0.152: v60.96,8.89 67.31,8.89 v68.58,10.16
INPN1
  Top 0.203: U7.INPN 103.18,34.19 R12.2 R13.1
INPN2
  Top 0.203: U12.INPN 103.18,22.89 R14.2 R15.1
INPN3
  Top 0.203: U13.INPN 103.18,11.59 R28.2 R29.1
INPUT1
  Top 0.152: U7.INPP 101.56,32.26 TP1.TP 107.95,35.56 108.97,36.58 111.51,36.58 111.89,36.96 U16.6 111.89,40.01 113.16,41.28 113.16,42.16 | 113.16,42.16 U16.2 113.16,45.59 112.78,45.97 111.51,45.97 111.39,45.85 111.37,45.85 111.15,45.63 111.15,42.27 111.51,41.91 112.9,41.91 113.16,42.16
INPUT2
  Top 0.152: U12.INPP 102.2,20.32 TP2.TP 107.95,21.08 108.97,22.1 111.76,22.1 111.89,22.23 U15.6 111.89,25.78 113.16,27.05 U15.2
INPUT3
  Top 0.152: U13.INPP 102.08,9.14 105.16,9.14 TP3.TP 105.92,8.64 107.19,7.37 111.76,7.37 111.89,7.49 U14.6 111.89,11.3 113.16,12.57 113.16,13.46 | 113.16,13.46 U14.2 113.16,16.38 112.78,16.76 111.51,16.76 111.39,16.64 111.37,16.64 111.23,16.51 111.23,15.32 111.25,15.3 111.25,13.21 111.51,12.95 112.65,12.95 113.16,13.46
N$1
  Top 0.254: U9.P$4 8.57,30.96 R21.1 R20.2
N$2
  pour Top (no thermals): 17.4,15.37 17.4,18.92 18.03,18.92 18.03,20.45 19.94,20.45 19.94,18.29 23.11,18.29 23.37,18.03 23.37,15.37 23.11,15.11 17.65,15.11
N$3
  Top 0.254: U8.P$1 19.03,21.73 R25.2 19.38,21.88 C28.2 R24.1
N$4
  pour Top (no thermals): 10.16,17.53 13.72,17.53 15.11,18.92 15.62,18.92 15.62,15.37 15.37,15.11 9.78,15.11 9.4,14.73 9.4,13.72 9.14,13.46 6.98,13.46 6.73,13.72 6.73,15.88 6.98,16.13 9.02,16.13 10.16,17.27
N$5
  pour Top (no thermals): 5.59,20.57 5.59,17.91 7.24,17.91 7.24,16.76 8.76,16.76 9.91,17.91 12.7,17.91 13.46,18.67 13.46,19.69 11.05,19.69 11.05,20.57
N$6
  Top 0.254: U8.P$4 16.01,22.89 R27.1 16.57,24.15 16.67,24.15 16.83,24.31 16.83,25.55 16,26.38 R26.2 C32.1
N$9
  Top 0.254: U$8.P$2 79.26,12.56 25MHZ1.P$4
N$10
  Top 0.254: 25MHZ1.P$2 81.03,13.94 81.03,13.34 80.76,13.06 U$8.P$3
N$11
  Top 0.406: R31.2 LED2.C
N$12
  Top 0.203: D4.2 46.61,29.19 R17.2 | R17.2 C11.1 | R17.2 45.66,26.42 40.39,26.42 38.61,24.64 U6.5 36.98,23.72 36.32,24.38 R18.2
N$13
  Top 0.203: D4.1 44.58,29.19 R16.1 41.59,27.37 41.15,27.81 U6.2
N$14
  Top 0.203: D4.3 43.14,31.45 42.42,30.73 U6.1
N$15
  Top 0.203: R19.2 35.69,29.02 35.69,30.58 U11.1
N$16
  Top 0.203: R18.1 36.79,28.09 U11.3
N$17
  Top 0.406: LED1.C R30.2
N$18
  Top 0.152: R32.1 116.75,17.61 117.86,16.51 117.86,8.89 | 117.86,8.89 H3.TP | J3.1 119.13,7.62 117.86,8.89
N$19
  Top 0.152: U14.3 111.89,15.79 R32.2
N$20
  Top 0.152: R33.1 116.5,32.09 117.86,30.73 117.86,26.67 | 117.86,26.67 H2.TP | J2.1 119.13,25.4 117.86,26.67
N$21
  Top 0.152: R33.2 111.89,30.27 U15.3
N$22
  Top 0.152: U16.3 111.89,45 R34.2
N$23
  Top 0.152: 117.86,44.45 117.86,45.47 116.5,46.82 R34.1 | 117.86,44.45 H1.TP | J1.1 119.13,43.18 117.86,44.45
N$24
  Top 0.203: R2A1.2 81.6,47.62 U$6.11
N$25
  Top 0.203: U$6.9 U$6.8
N$26
  Top 0.203: U$6.12 R1A1.2 84.77,47 R2A1.1 R3A1.1
N$27
  Top 0.203: U$6.14 69.21,47.62 67.95,46.36 R2D1.2
N$28
  Top 0.203: R1D1.2 65.09,47.62 | 65.09,47.62 R2D1.1 R3D1.1 | 65.09,47.62 67.95,47.62 69.21,48.9 U$6.13
N$29
  Top 0.203: U$6.16 U$6.17
N$30
  Top 0.203: R2C1.1 67.95,37.47 69.21,36.2 U$6.23
N$31
  Top 0.203: U$6.24 69.21,34.92 67.95,36.2 66.36,36.2 65.25,35.08 | 65.25,35.08 R1C1.1 | 65.25,35.08 65.09,35.24 R2C1.2 R3C1.2
N$33
  Top 0.203: U$6.2 81.6,36.2 R2B1.2
N$34
  Top 0.203: U$6.1 R1B1.2 82.87,35.56 R2B1.1 R3B1.1
N$35
  Top 0.203: U$6.5 U$6.4
N$36
  Top 0.203: U$6.21 U$6.20
N$37  (via drill 0.35)
  Bottom 0.203: RCLK1.1 69.02,42.55 v70.33,42.55
N$38
  Top 0.203: R2A2.2 81.6,29.84 U$7.11
N$39
  Top 0.203: U$7.9 U$7.8
N$40
  Top 0.203: U$7.12 R1A2.2 84.77,29.22 R2A2.1 R3A2.1
N$41
  Top 0.203: U$7.14 69.09,29.84 67.82,28.58 R2D2.2
N$42
  Top 0.203: R3D2.1 R2D2.1 65.09,29.84 | R1D2.2 65.09,29.84 | U$7.13 69.21,31.12 67.95,29.84 65.09,29.84
N$43
  Top 0.203: U$7.16 U$7.17
N$50  (via drill 0.35)
  Bottom 0.203: RCLK2.1 70.27,24.83 v70.33,24.77
OUT_2ND_A1
  Top 0.203: R3A1.2 82.87,44.13 80.64,46.36 U$6.10 78.11,46.36 74.93,49.53 67.63,49.53 R1D1.1
OUT_2ND_A2
  Top 0.203: R3A2.2 82.87,26.35 80.64,28.58 U$7.10 78.11,28.58 74.93,31.75 67.06,31.75 R1D2.1
OUT_2ND_ORDER_B1
  Top 0.203: R3B1.2 82.87,39.69 80.64,37.47 U$6.3 78.11,37.47 74.93,34.29 66.99,34.29 R1C1.2
PEAK_CLEAR
  Top 0.203: R19.1 34.29,22.86 U1.23/A9
PEAK_OUT
  Top 0.203: R17.1 R16.2 44.38,25.27 41.78,25.27 41.15,24.64 U6.7 U6.6 TP10.TP 41.91,18.8 U1.22/A8
SIG_OUT_0
  Top 0.152: U2.10 41,41 44.45,44.45 JP1.5
  Top 0.203: U2.10 U2.11
SIG_OUT_1
  Top 0.152: U2.15 37.82,37.75 37.47,38.1 37.47,41.66 39.37,43.56 JP1.3
  Top 0.203: U2.15 U2.16
SIG_OUT_2
  Top 0.152: U2.1 46.11,36.45 45.21,35.56 40.13,35.56 | JP1.1 34.29,39.37 38.1,35.56 39.62,35.56 | 39.62,35.56 39.88,35.56 | 39.88,35.56 40.13,35.56 | U6.3 39.88,31.51 39.9,31.53 39.9,31.97 39.88,31.99 39.88,35.31 | 39.88,35.31 39.88,35.56 | 40.13,35.56 39.88,35.31 | 39.62,35.56 39.88,35.31
  Top 0.203: U2.2 U2.1
SS3  (via drill 0.26, 0.35)
  Top 0.203: U8.P$7 16.01,18.17 v15.88,18.03 | v14.1,9.4 14.01,9.31 R22.1 10.75,9.31 C26.1
  Route15 0.203: v15.88,18.03 15.88,10.8 14.48,9.4 v14.1,9.4
SS4  (via drill 0.26, 0.35)
  Top 0.203: U8.P$9 17.01,18.17 v17.14,18.03 | v18.67,9.27 20.28,9.27 R23.1 22.27,9.31 C27.1
  Route15 0.203: v17.14,18.03 17.14,10.8 v18.67,9.27
UART1_RXD
  Top 0.152: JP8.2 U1.0
UART1_TXD
  Top 0.152: JP8.1 U1.1
V+
  Top 0.254: U8.P$8 C25.1
  Top 1.27: CON4.1 6.86,11.43 10.69,11.43 L2.P$1 | U1.VIN 27.26,13.29 L1.P$1
  pour Top (no thermals): 23.5,10.67 23.5,14.48 23.24,14.73 10.03,14.73 9.78,14.48 9.78,10.67 10.03,10.41 13.97,10.41 14.86,11.43 18.16,11.43 19.05,10.41 23.24,10.41
  pour Top: 17.02,14.99 17.02,17.02 16.64,17.4 16.38,17.4 16,17.02 16,14.99 15.62,14.61 15.62,11.68 17.27,11.68 17.4,11.81 17.4,14.61
VGA_INPUT1
  Top 0.2: U7.VGAI U7.PRAO
  Top 0.203: R12.1 102.93,36.14 U7.PRAO
VGA_INPUT2
  Top 0.2: U12.VGAI U12.PRAO
  Top 0.203: R14.1 102.93,24.84 U12.PRAO
VGA_INPUT3
  Top 0.2: U13.VGAI U13.PRAO
  Top 0.203: R28.1 102.93,13.54 U13.PRAO
VNEG1
  Top 0.305: C21.1 99.88,37.65 U7.VNEG
  Top 1.016: C21.1 101.48,37.77 L4.1
VNEG2
  Top 0.305: C40.1 99.88,26.35 U12.VNEG
  Top 1.016: C40.1 101.48,26.47 L7.1
VNEG3
  Top 0.305: C46.1 99.88,15.05 U13.VNEG
  Top 1.016: C46.1 101.48,15.17 L11.1
VPOS1
  Top 0.305: C36.1 96.66,36.14 U7.VPOS
  Top 1.016: L5.1 94.24,36.7 C36.1
VPOS2
  Top 0.305: C42.1 96.66,24.84 U12.VPOS
  Top 1.016: L8.1 94.11,25.4 C42.1
VPOS3
  Top 0.305: C48.1 96.66,13.54 U13.VPOS
  Top 1.016: L12.1 94.37,14.1 C48.1
VREF
  Top 0.254: U8.P$3 U8.P$2 17.01,22.89 R27.2 17.69,23.57 C31.1

### Text on the board
tPlace: +5V | HYDROPHONE SIGNAL / PROCESSOR V4 / Rev. 1: 11/2018 | CREDIT: / NICHOLAS K. / MOIRA B. / KOLTIN K.-H. / DAVID L. / ALAIN L. / Andrew S. | GND / REFS | CLK2 | CLK1 | GND | 5V | RX | SCL | SDA | -5V | TX | 12 | 11 | G
bPlace: 08 | 09 | 10